# EAGLE board EEZ DIB MIO168 r2B4 (EAGLE 7.2.0), part 1 of 2
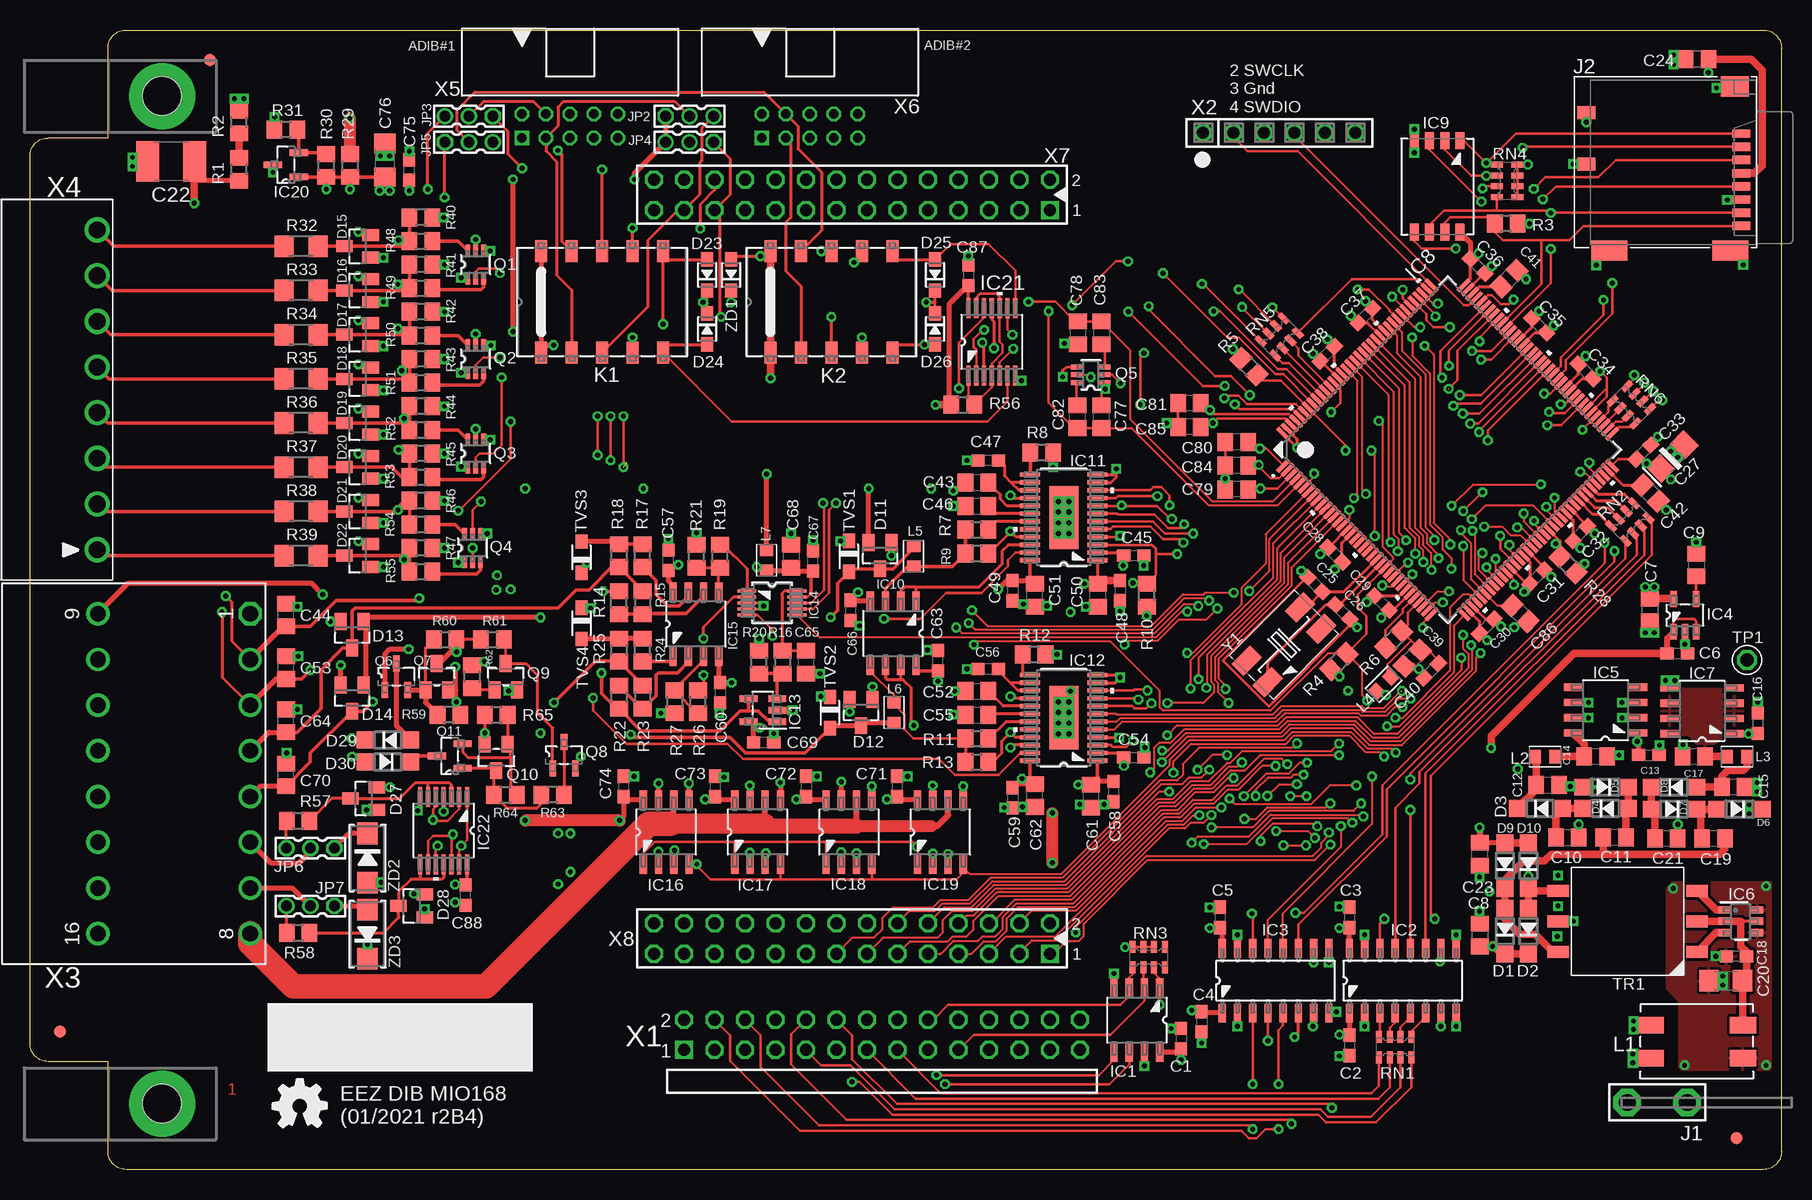
[diagram p6: board, top side]
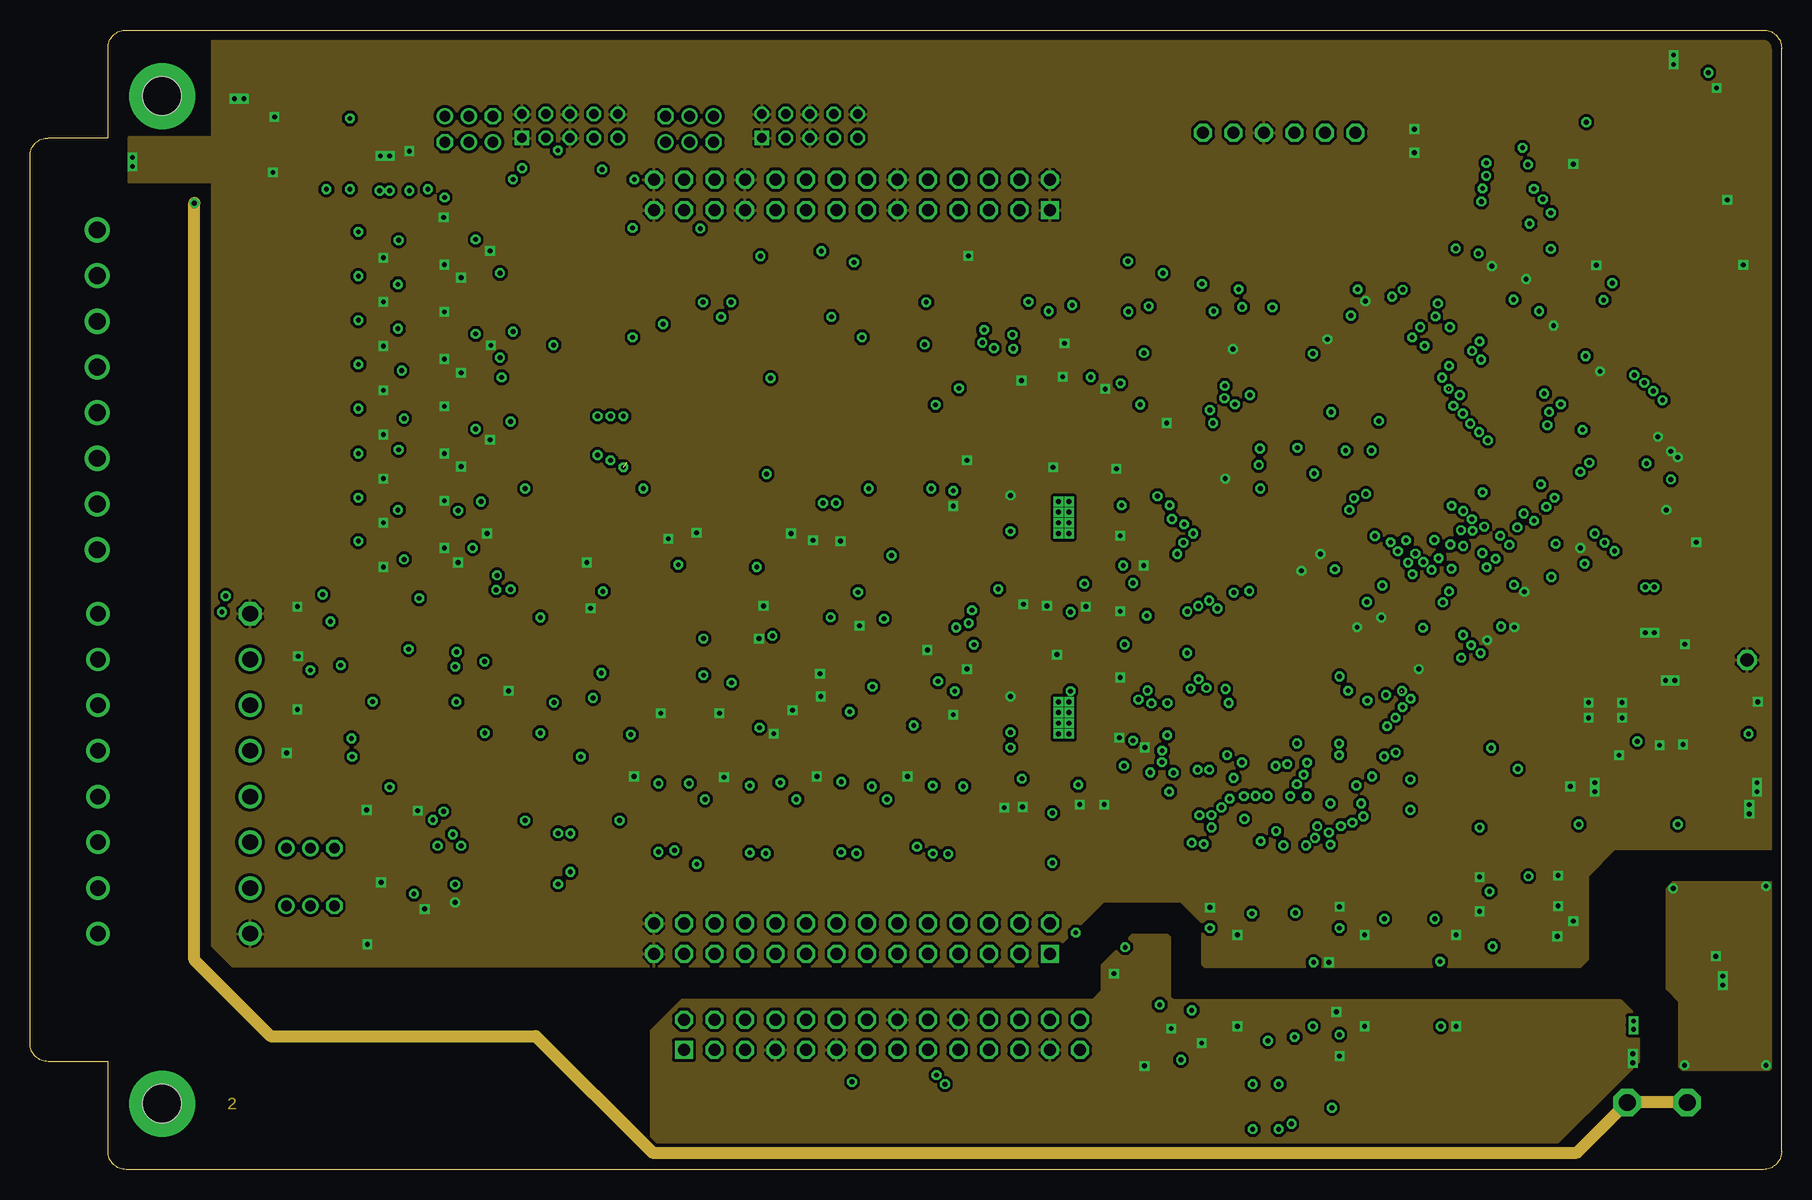
[diagram p7: board, inner layer L2]
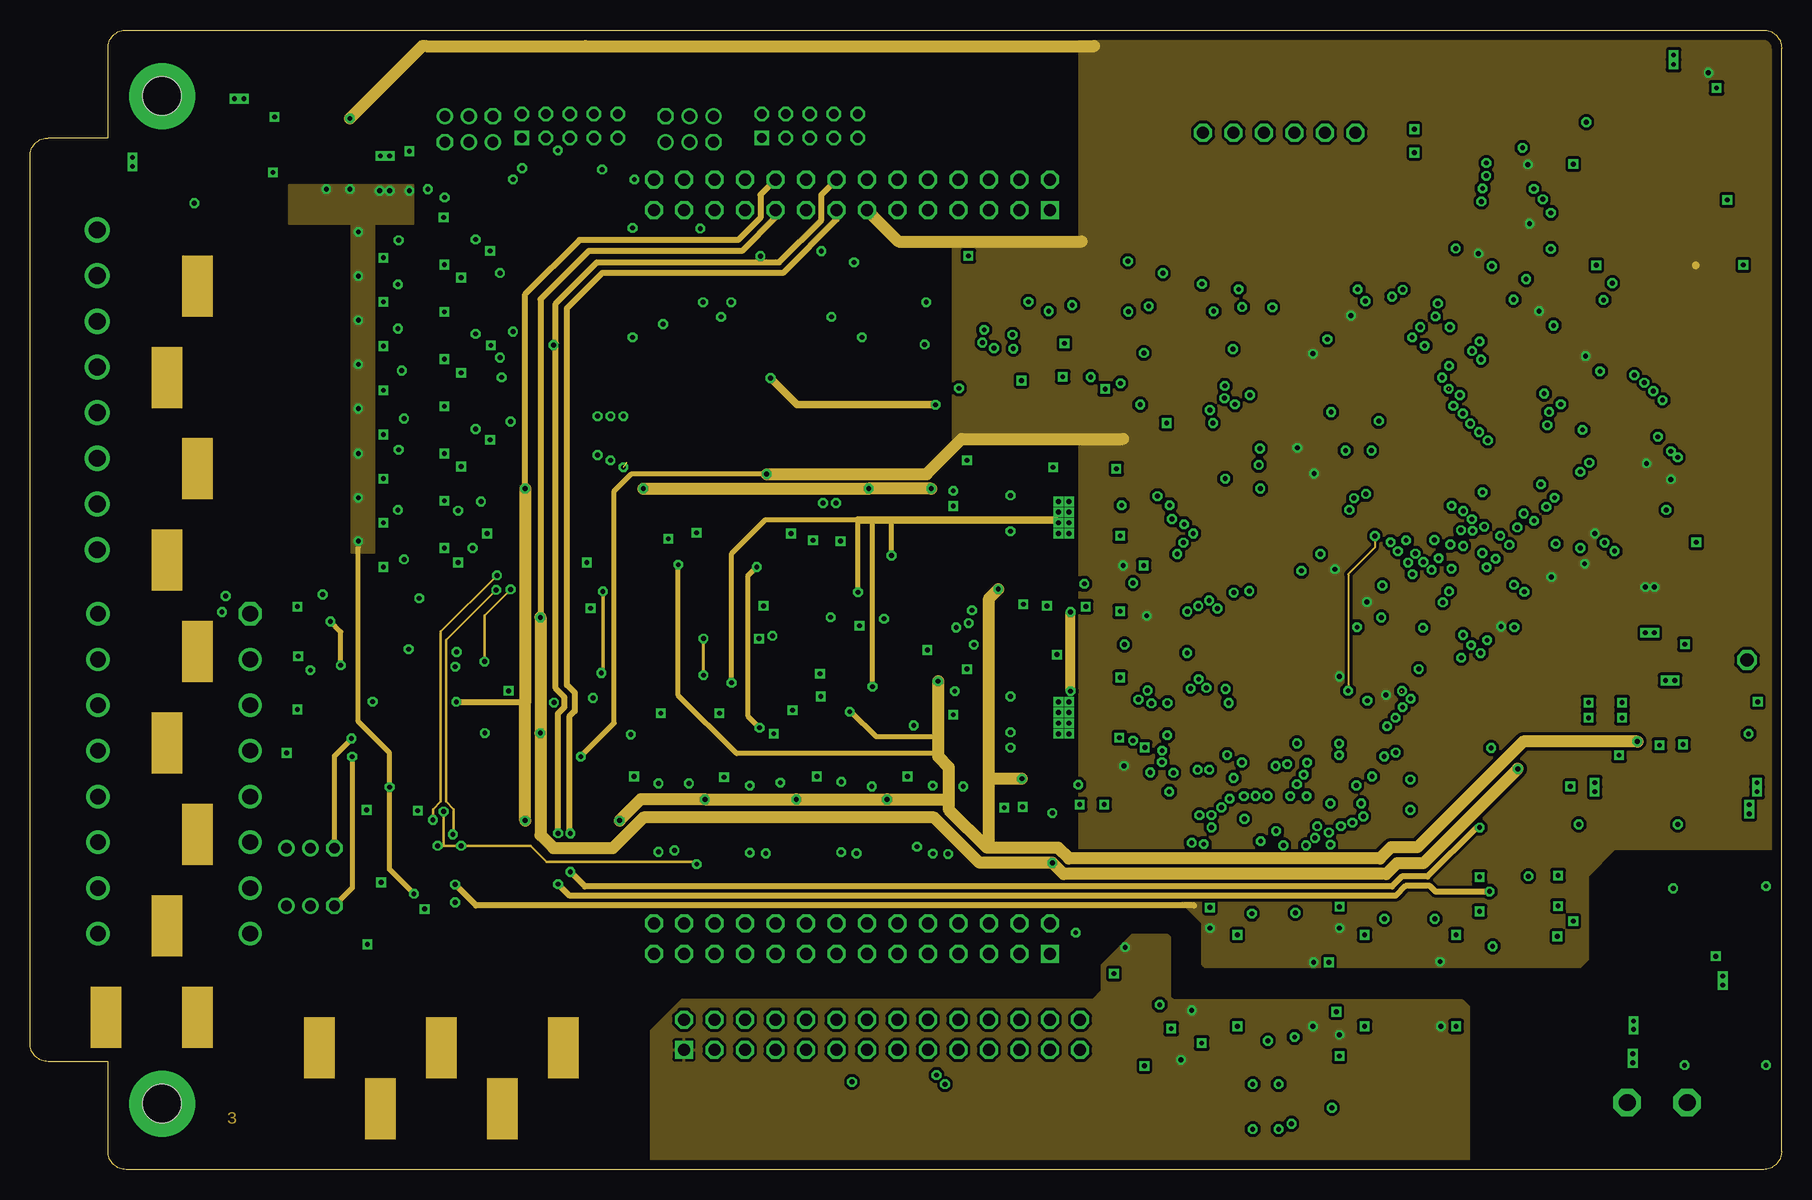
[diagram p8: board, inner layer L3]
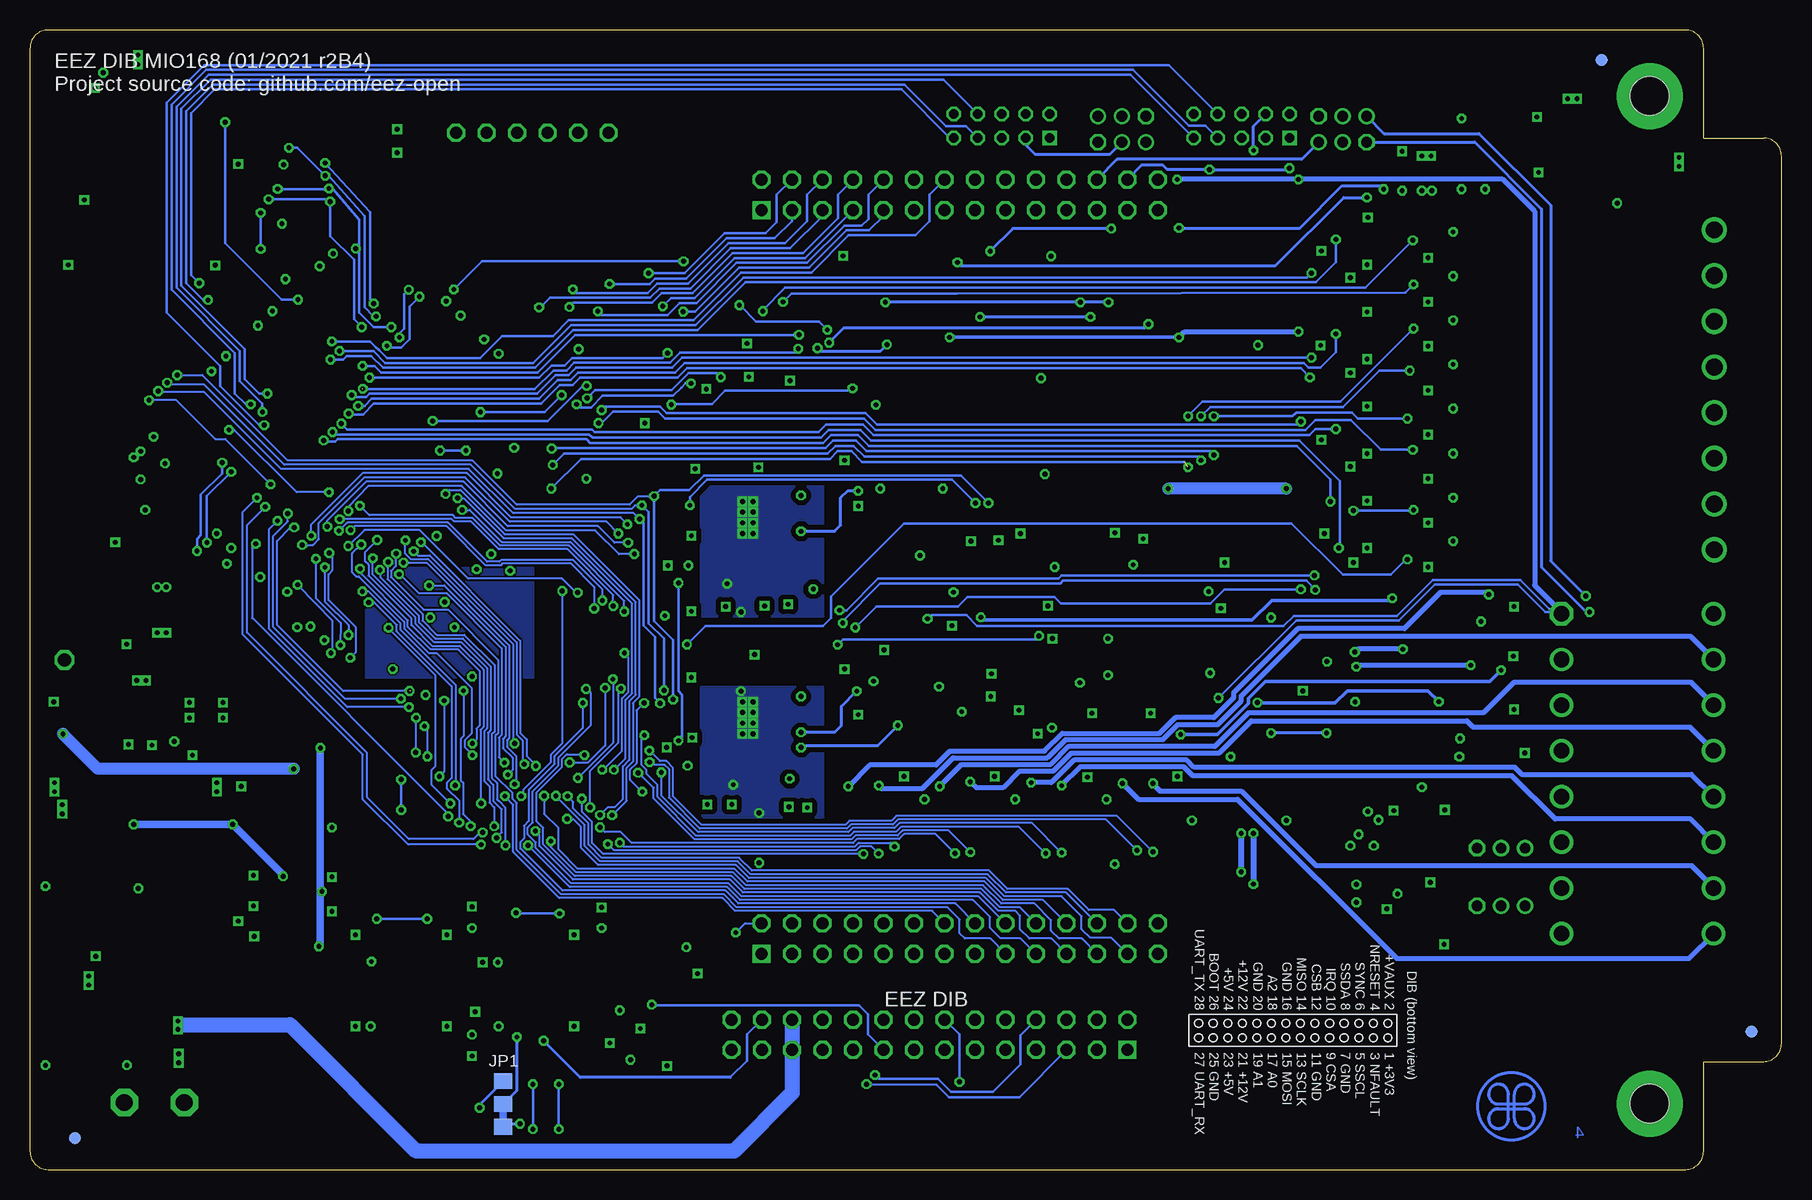
[diagram p9: board, bottom side, seen from below]

Size 146 x 95 mm. Coordinates in mm from the lower left corner, seen from the top.
Outline: 8,95 144.5,95 arc-90 146,93.5 146,1.5 arc-90 144.5,0 8,0 arc-90 6.5,1.5 6.5,9 1.5,9 arc-90 0,10.5 0,84.5 arc-90 1.5,86 6.5,86 6.5,93.5 arc-90 8,95
Copper layers (1+2+15+16): Top 0.035559375mm / dielectric 7mil / L2 0.03048125mm / dielectric 44mil / L3 0.03048125mm / dielectric 7mil / Bottom 0.035559375mm
Design rules "DIB 4-layer": minimum track width 6mil, minimum drill 0.3mm, track to track 4mil, track to pad 4mil, pad to pad 4mil, via to via 4mil, smd to smd 4mil, copper to edge 30mil, drill to drill 8mil, minimum pad ring 4mil, minimum via ring 8mil, stop-mask expansion 2.5mil, vias tented up to drill 0.6mm, thermal gap 8mil
Net classes: 0 default: width 0.152 mm, drill 0.3 mm, clearance 0.152 mm; 1 lvds: width 0.152 mm, drill 0.3 mm, clearance 0.152 mm to class 0, clearance 0.152 mm; 2 gnd: width 0.254 mm, drill 0.584 mm, clearance 0.254 mm; 3 diff_in: width 0.254 mm, drill 0.584 mm, clearance 0.203 mm to class 0, clearance 0.203 mm to class 1, clearance 0.203 mm to class 2, clearance 0.203 mm
vRestrict: area 0,0 to 42,14; area 53,0 to 128,8.5

## Footprints (pad centres in the part's own frame; a part is rotated, then mirrored left to right if it is on the bottom)
C0603 = smd 1.1 x 1: 1 -0.85,0; 2 0.85,0
C0805 = smd 1.3 x 1.5: 1 -0.95,0; 2 0.95,0
C1206 = smd 1.6 x 1.8: 1 -1.4,0; 2 1.4,0
C1812 = smd 1.9 x 3.4: 1 -1.95,0; 2 1.95,0
EC1206 = smd 1.6 x 1.8: + -1.4,0; - 1.4,0
SOD123 = smd 1.4 x 1.4: A 1.9,0; C -1.9,0
SOT23 = smd 1 x 1.4: 1 -0.95,-1.1; 2 0.95,-1.1; 3 0,1.1
SOD323-R = smd 1.2 x 1: A 1.3,0; C -1.3,0
FIDUCIAL_DUAL = smd 1.016 x 1.016 bottom: B 0,0 | smd 1.016 x 1.016: T 0,0
SOIC127P600X173-8N = smd 1.55 x 0.6: 1 -2.7,1.9; 2 -2.7,0.63; 3 -2.7,-0.64; 4 -2.7,-1.91; 5 2.7,-1.91; 6 2.7,-0.64; 7 2.7,0.63; 8 2.7,1.9
SOIC-16 = smd 1.549 x 0.61: 1 -2.692,4.445; 2 -2.692,3.175; 3 -2.692,1.905; 4 -2.692,0.635; 5 -2.692,-0.635; 6 -2.692,-1.905; 7 -2.692,-3.175; 8 -2.692,-4.445; 9 2.692,-4.445; 10 2.692,-3.175; 11 2.692,-1.905; 12 2.692,-0.635; 13 2.692,0.635; 14 2.692,1.905; 15 2.692,3.175; 16 2.692,4.445
SOT95P270X145-5N = smd 1.321 x 0.559: 1 -1.372,0.94; 2 -1.372,0; 3 -1.372,-0.94; 4 1.372,-0.94; 5 1.372,0.94
DBV0006A_N = smd 1 x 0.6: 1 -1.375,0.95; 2 -1.375,0; 3 -1.375,-0.95; 4 1.375,-0.95; 5 1.375,0; 6 1.375,0.95
LQFP-144 = smd 1.35 x 0.35: 1 -10.625,8.75; 2 -10.625,8.25; 3 -10.625,7.75; 4 -10.625,7.25; 5 -10.625,6.75; 6 -10.625,6.25; 7 -10.625,5.75; 8 -10.625,5.25; 9 -10.625,4.75; 10 -10.625,4.25; 11 -10.625,3.75; 12 -10.625,3.25; 13 -10.625,2.75; 14 -10.625,2.25; 15 -10.625,1.75; 16 -10.625,1.25; 17 -10.625,0.75; 18 -10.625,0.25; 19 -10.625,-0.25; 20 -10.625,-0.75; 21 -10.625,-1.25; 22 -10.625,-1.75; 23 -10.625,-2.25; 24 -10.625,-2.75; 25 -10.625,-3.25; 26 -10.625,-3.75; 27 -10.625,-4.25; 28 -10.625,-4.75; 29 -10.625,-5.25; 30 -10.625,-5.75; 31 -10.625,-6.25; 32 -10.625,-6.75; 33 -10.625,-7.25; 34 -10.625,-7.75; 35 -10.625,-8.25; 36 -10.625,-8.75; 73 10.625,-8.75; 74 10.625,-8.25; 75 10.625,-7.75; 76 10.625,-7.25; 77 10.625,-6.75; 78 10.625,-6.25; 79 10.625,-5.75; 80 10.625,-5.25; 81 10.625,-4.75; 82 10.625,-4.25; 83 10.625,-3.75; 84 10.625,-3.25; 85 10.625,-2.75; 86 10.625,-2.25; 87 10.625,-1.75; 88 10.625,-1.25; 89 10.625,-0.75; 90 10.625,-0.25; 91 10.625,0.25; 92 10.625,0.75; 93 10.625,1.25; 94 10.625,1.75; 95 10.625,2.25; 96 10.625,2.75; 97 10.625,3.25; 98 10.625,3.75; 99 10.625,4.25; 100 10.625,4.75; 101 10.625,5.25; 102 10.625,5.75; 103 10.625,6.25; 104 10.625,6.75; 105 10.625,7.25; 106 10.625,7.75; 107 10.625,8.25; 108 10.625,8.75 | smd 0.35 x 1.35: 37 -8.75,-10.625; 38 -8.25,-10.625; 39 -7.75,-10.625; 40 -7.25,-10.625; 41 -6.75,-10.625; 42 -6.25,-10.625; 43 -5.75,-10.625; 44 -5.25,-10.625; 45 -4.75,-10.625; 46 -4.25,-10.625; 47 -3.75,-10.625; 48 -3.25,-10.625; 49 -2.75,-10.625; 50 -2.25,-10.625; 51 -1.75,-10.625; 52 -1.25,-10.625; 53 -0.75,-10.625; 54 -0.25,-10.625; 55 0.25,-10.625; 56 0.75,-10.625; 57 1.25,-10.625; 58 1.75,-10.625; 59 2.25,-10.625; 60 2.75,-10.625; 61 3.25,-10.625; 62 3.75,-10.625; 63 4.25,-10.625; 64 4.75,-10.625; 65 5.25,-10.625; 66 5.75,-10.625; 67 6.25,-10.625; 68 6.75,-10.625; 69 7.25,-10.625; 70 7.75,-10.625; 71 8.25,-10.625; 72 8.75,-10.625; 109 8.75,10.625; 110 8.25,10.625; 111 7.75,10.625; 112 7.25,10.625; 113 6.75,10.625; 114 6.25,10.625; 115 5.75,10.625; 116 5.25,10.625; 117 4.75,10.625; 118 4.25,10.625; 119 3.75,10.625; 120 3.25,10.625; 121 2.75,10.625; 122 2.25,10.625; 123 1.75,10.625; 124 1.25,10.625; 125 0.75,10.625; 126 0.25,10.625; 127 -0.25,10.625; 128 -0.75,10.625; 129 -1.25,10.625; 130 -1.75,10.625; 131 -2.25,10.625; 132 -2.75,10.625; 133 -3.25,10.625; 134 -3.75,10.625; 135 -4.25,10.625; 136 -4.75,10.625; 137 -5.25,10.625; 138 -5.75,10.625; 139 -6.25,10.625; 140 -6.75,10.625; 141 -7.25,10.625; 142 -7.75,10.625; 143 -8.25,10.625; 144 -8.75,10.625
LGA8 = smd 1.4 x 0.75: 1 -3.81,1.905; 2 -3.81,0.635; 3 -3.81,-0.635; 4 -3.81,-1.905; 5 3.81,-1.905; 6 3.81,-0.635; 7 3.81,0.635; 8 3.81,1.905
PWP24 = smd 1.676 x 0.356: 1 -2.819,3.575; 2 -2.819,2.925; 3 -2.819,2.275; 4 -2.819,1.625; 5 -2.819,0.975; 6 -2.819,0.325; 7 -2.819,-0.325; 8 -2.819,-0.975; 9 -2.819,-1.625; 10 -2.819,-2.275; 11 -2.819,-2.925; 12 -2.819,-3.575; 13 2.819,-3.575; 14 2.819,-2.925; 15 2.819,-2.275; 16 2.819,-1.625; 17 2.819,-0.975; 18 2.819,-0.325; 19 2.819,0.325; 20 2.819,0.975; 21 2.819,1.625; 22 2.819,2.275; 23 2.819,2.925; 24 2.819,3.575 | smd 2.413 x 5.283: 25 0,0
DBV5 = smd 1.473 x 0.559: 1 -1.194,0.95; 2 -1.194,0; 3 -1.194,-0.95; 4 1.194,-0.95; 5 1.194,0.95
DGS10 = smd 1.575 x 0.254: 1 -2.095,1; 2 -2.095,0.5; 3 -2.095,0; 4 -2.095,-0.5; 5 -2.095,-1; 6 2.095,-1; 7 2.095,-0.5; 8 2.095,0; 9 2.095,0.5; 10 2.095,1
SOT103P240X110-3N = smd 1.524 x 0.559: 1 -1.079,1.016; 2 -1.079,-1.016; 3 1.079,0
PW14 = smd 1.676 x 0.356: 1 -2.819,1.95; 2 -2.819,1.3; 3 -2.819,0.65; 4 -2.819,0; 5 -2.819,-0.65; 6 -2.819,-1.3; 7 -2.819,-1.95; 8 2.819,-1.95; 9 2.819,-1.3; 10 2.819,-0.65; 11 2.819,0; 12 2.819,0.65; 13 2.819,1.3; 14 2.819,1.95
PCB_TAB-4907 = drill 1.4 pad 2.3 octagon: 1 -2.5,0; 2 2.5,0
5033981892 = smd 0.7 x 1.5: 1 4.45,12.6; 2 5.55,12.6; 3 6.65,12.6; 4 7.75,12.6; 5 8.85,12.6; 6 9.95,12.6; 7 11.05,12.6; 8 12.15,12.6 | smd 1.7 x 2.33: S 0.5,12.04 | smd 1.7 x 3: S1 14.2,11.7; S2 14.2,1.6 | smd 1.1 x 1.5: SW1 2.7,-0.3; SW2 7,-0.3
JP3-0805-CUT2 = smd 1.3 x 1.5: COM 0,0; NC 1.9,0; NO -1.9,0
ZL303-03P = drill 0.9 pad 1.27: 1 2,0; 2 0,0 | drill 0.9 pad 1.27 octagon: 3 -2,0
PANASONIC_TQ2_SS = smd 1.84 x 1: 1 -4.23,5.08; 2 -4.23,2.54; 3 -4.23,0; 4 -4.23,-2.54; 5 -4.23,-5.08; 6 4.23,-5.08; 7 4.23,-2.54; 8 4.23,0; 9 4.23,2.54; 10 4.23,5.08
PCB-MB = hole 3.2: 0,0
SRF0905 = smd 2.2 x 1.4: 1 3.85,-1.37; 2 3.85,1.37; 3 -3.85,1.37; 4 -3.85,-1.37
BEAD0603 = smd 1 x 1.1: P$1 -0.85,0; P$2 0.85,0
SC88 = smd 0.991 x 0.406: 1 -1.168,0.65; 2 -1.168,0; 3 -1.168,-0.65; 4 1.168,-0.65; 5 1.168,0; 6 1.168,0.65
SOT95P237X112-3N = smd 1.321 x 0.559: 1 -1.092,0.94; 2 -1.092,-0.94; 3 1.092,0
SOT23-BEC = smd 1 x 1.4: B -0.95,-1.1; C 0,1.1; E 0.95,-1.1
R0805 = smd 1.3 x 1.5: 1 -0.95,0; 2 0.95,0
R1206 = smd 1.6 x 1.803: 1 -1.422,0; 2 1.422,0
CAY16 = smd 0.5 x 1: 1 -1.35,-0.85; 2 -0.45,-0.85; 3 0.45,-0.85; 4 1.35,-0.85; 5 1.35,0.85; 6 0.45,0.85; 7 -0.45,0.85; 8 -1.35,0.85
SHORT_NOHOLE = smd 0.5 x 0.25 bottom: 1 0,0.117; 2 0,-0.117
PCB_SHIELD_TAB = drill 1.1 octagon: 1 0,0
MURATA_78615 = smd 1.8 x 1: 1 -5.8,2.54; 2 -5.8,0; 3 -5.8,-2.54; 4 5.8,-2.54; 5 5.8,0; 6 5.8,2.54
SOD323-BIDIR = smd 1.2 x 1: C1 -1.3,0; C2 1.3,0
77317-104-28LF = drill 1 pad 1.5 square: 1 -33.02,-2.54 | drill 1 pad 1.5 octagon: 2 -33.02,0; 3 -30.48,-2.54; 4 -30.48,0; 5 -27.94,-2.54; 6 -27.94,0; 7 -25.4,-2.54; 8 -25.4,0; 9 -22.86,-2.54; 10 -22.86,0; 11 -20.32,-2.54; 12 -20.32,0; 13 -17.78,-2.54; 14 -17.78,0; 15 -15.24,-2.54; 16 -15.24,0; 17 -12.7,-2.54; 18 -12.7,0; 19 -10.16,-2.54; 20 -10.16,0; 21 -7.62,-2.54; 22 -7.62,0; 23 -5.08,-2.54; 24 -5.08,0; 25 -2.54,-2.54; 26 -2.54,0; 27 0,-2.54; 28 0,0
SSW-106-02-S-S = drill 1 pad 1.5 octagon: 1 -6.35,0; 2 -3.81,0; 3 -1.27,0; 4 1.27,0; 5 3.81,0; 6 6.35,0
691327310016 = drill 1.3 octagon: 1 -13.335,6.35 | drill 1.3: 2 -9.525,6.35; 3 -5.715,6.35; 4 -1.905,6.35; 5 1.905,6.35; 6 5.715,6.35; 7 9.525,6.35; 8 13.335,6.35; 9 -13.335,-6.35; 10 -9.525,-6.35; 11 -5.715,-6.35; 12 -1.905,-6.35; 13 1.905,-6.35; 14 5.715,-6.35; 15 9.525,-6.35; 16 13.335,-6.35
691322310008 = drill 1.4: 1 -13.335,0; 2 -9.525,0; 3 -5.715,0; 4 -1.905,0; 5 1.905,0; 6 5.715,0; 7 9.525,0; 8 13.335,0
DS1014-10RF1B = drill 0.8 square: 1 -4,-1 | drill 0.8 octagon: 2 -4,1; 3 -2,-1; 4 -2,1; 5 0,-1; 6 0,1; 7 2,-1; 8 2,1; 9 4,-1; 10 4,1
TSW-114-07-F-D = drill 1 pad 1.5 square: 1 33.02,0 | drill 1 pad 1.5 octagon: 2 33.02,2.54; 3 30.48,0; 4 30.48,2.54; 5 27.94,0; 6 27.94,2.54; 7 25.4,0; 8 25.4,2.54; 9 22.86,0; 10 22.86,2.54; 11 20.32,0; 12 20.32,2.54; 13 17.78,0; 14 17.78,2.54; 15 15.24,0; 16 15.24,2.54; 17 12.7,0; 18 12.7,2.54; 19 10.16,0; 20 10.16,2.54; 21 7.62,0; 22 7.62,2.54; 23 5.08,0; 24 5.08,2.54; 25 2.54,0; 26 2.54,2.54; 27 0,0; 28 0,2.54
12SMX(B) = smd 2.2 x 1.4: 1 -3.15,-1.25; 2 3.14,-1.25; 3 3.15,1.25; 4 -3.15,1.25
DO214AC = smd 1.8 x 1.7: A 2.05,0; C -2.05,0

## Placement (x,y rotation side)
C1  100n  [C0603]  95.95,10.92 270 top
C2  100n  [C0603]  109.98,10.35 270 top
C3  100n  [C0603]  109.98,21.02 270 top
C4  100n  [C0603]  97.66,12.32 270 top
C5  100n  [C0603]  99.19,21.02 270 top
C6  100n  [C0603]  137.31,43.03 0 top
C7  2u2  [C0805]  135.03,46.65 270 top
C8  4u7  [C0805]  120.84,19.56 270 top
C9  10n  [C0805]  138.9,50.39 270 top
C10  1u  [C0805]  128.14,27.69 0 top
C11  1u  [C0805]  132.08,27.69 180 top
C12  4u7  [C0805]  126.49,32.07 0 top
C13  100n  [C0603]  134.94,34.54 0 top
C14  1u  [C0805]  130.49,34.42 180 top
C15  4u7  [C0805]  141.99,31.88 180 top
C16  100n  [C0603]  144.02,37.21 270 top
C17  1u  [C0805]  138.68,34.42 180 top
C18  100n  [C0603]  142.24,17.78 180 top
C19  1u  [C0805]  140.34,27.62 0 top
C20  10u  [C1206]  141.35,15.75 0 top
C21  1u  [C0805]  136.4,27.62 0 top
C22  4n7/1kV  [C1812]  11.77,84.05 180 top
C23  4u7  [C0805]  120.84,26.29 90 top
C24  N.C.  [C0805]  138.95,92.57 180 top
C25  4p7  [C0603]  107.12,48.77 315 top
C26  4p7  [C0603]  109.41,46.48 135 top
C27  4u7  [EC1206]  136.91,59.44 45 top
C28  100n  [C0603]  108.8,51.26 135 top
C29  100n  [C0603]  112.69,47.23 315 top
C30  100n  [C0603]  121.42,45.29 225 top
C31  100n  [C0603]  125.6,49.4 225 top
C32  100n  [C0603]  129.22,53.02 225 top
C33  100n  [C0603]  134.49,59.82 45 top
C34  100n  [C0603]  129.67,66.55 315 top
C35  100n  [C0603]  125.79,70.36 315 top
C36  100n  [C0603]  120.68,75.31 315 top
C37  100n  [C0603]  111.32,71.18 45 top
C38  100n  [C0603]  108.14,68.01 45 top
C39  1u  [C0805]  115.23,42.62 225 top
C40  100n  [C0603]  116.8,41.58 225 top
C41  2u2  [C0805]  123.29,74.28 225 top
C42  2u2  [C0805]  135.06,56.39 135 top
C43  2n2  [C0805]  78.93,57.28 0 top
C44  1n  [C0805]  21.34,46.23 90 top
C45  100n  [C0603]  92.01,51.18 0 top
C46  22n  [C0805]  78.93,55.31 0 top
C47  100n  [C0603]  79.88,59.12 180 top
C48  100n  [C0603]  90.87,48.26 270 top
C49  100n  [C0603]  81.92,48.26 270 top
C50  4u7  [C0805]  89.03,47.88 90 top
C51  4u7  [C0805]  83.76,47.88 90 top
C52  2n2  [C0805]  78.93,39.88 0 top
C53  1n  [C0805]  21.34,41.85 90 top
C54  100n  [C0603]  92.01,34.35 0 top
C55  22n  [C0805]  78.93,37.91 0 top
C56  100n  [C0603]  79.88,41.72 180 top
C57  100n  [C0603]  53.21,50.8 90 top
C58  100n  [C0603]  90.3,31.51 270 top
C59  100n  [C0603]  81.92,30.99 270 top
C60  100n  [C0603]  57.53,39.75 270 top
C61  4u7  [C0805]  88.46,31.13 90 top
C62  4u7  [C0805]  83.76,31.18 90 top
C63  100n  [C0603]  75.69,42.42 90 top
C64  1n  [C0805]  21.34,37.4 90 top
C65  150n  [C0805]  64.71,42.29 90 top
C66  100n  [C0603]  68.39,46.61 270 top
C67  100n  [C0603]  65.28,50.74 90 top
C68  4u7  [C0805]  63.44,51.12 270 top
C69  100n  [C0603]  61.15,35.62 0 top
C70  1n  [C0805]  21.34,32.89 90 top
C71  100n  [C0603]  72.26,31.94 270 top
C72  100n  [C0603]  64.71,31.94 270 top
C73  100n  [C0603]  57.09,31.94 270 top
C74  100n  [C0603]  49.47,31.94 270 top
C75  100n  [C0603]  31.62,83.31 90 top
C76  10u  [C1206]  29.59,84.14 90 top
C77  100p  [C0805]  89.31,62.76 90 top
C78  100p  [C0805]  87.34,69.75 270 top
C79  10n  [C0805]  100.58,56.71 180 top
C80  10n  [C0805]  100.58,60.64 180 top
C81  10n  [C0805]  96.65,63.88 180 top
C82  10n  [C0805]  87.33,62.76 90 top
C83  10n  [C0805]  89.31,69.75 270 top
C84  10n  [C0805]  100.58,58.67 180 top
C85  10n  [C0805]  96.65,61.91 180 top
C86  100p  [C0805]  124.21,46.35 315 top
C87  100n  [C0603]  78.22,74.54 270 top
C88  100n  [C0603]  36.32,22.87 90 top
D1  MBR0530T3G  [SOD123]  122.94,19.88 90 top
D2  MBR0530T3G  [SOD123]  124.9,19.88 90 top
D3  MBR0530T3G  [SOD123]  125.86,30.1 0 top
D4  MBR0530T3G  [SOD123]  131.32,30.1 0 top
D5  MBR0530T3G  [SOD123]  131.32,31.88 180 top
D6  MBR0530T3G  [SOD123]  142.49,30.04 180 top
D7  MBR0530T3G  [SOD123]  137.03,30.04 180 top
D8  MBR0530T3G  [SOD123]  137.03,31.88 0 top
D9  MBR0530T3G  [SOD123]  122.94,25.34 90 top
D10  MBR0530T3G  [SOD123]  124.9,25.34 90 top
D11  N.C.  [SOT23]  70.87,51.18 180 top
D12  N.C.  [SOT23]  69.28,38.1 180 top
D13  N.C.  [SOT23]  26.86,44.58 180 top
D14  N.C.  [SOT23]  26.86,39.31 180 top
D15  BAT54SFILM  [SOT23]  27.3,76.96 90 top
D16  BAT54SFILM  [SOT23]  27.3,73.28 90 top
D17  BAT54SFILM  [SOT23]  27.3,69.6 90 top
D18  BAT54SFILM  [SOT23]  27.3,65.91 90 top
D19  BAT54SFILM  [SOT23]  27.3,62.23 90 top
D20  BAT54SFILM  [SOT23]  27.3,58.55 90 top
D21  BAT54SFILM  [SOT23]  27.3,54.86 90 top
D22  BAT54SFILM  [SOT23]  27.3,51.18 90 top
D23  BAS316  [SOD323-R]  56.44,74.57 90 top
D24  BAS316  [SOD323-R]  56.44,70.08 270 top
D25  BAS316  [SOD323-R]  75.44,74.57 90 top
D26  BAS316  [SOD323-R]  75.44,70.08 270 top
D27  BAT54SFILM  [SOT23]  27.81,30.92 90 top
D28  BAT54SFILM  [SOT23]  31.81,21.97 90 top
D29  MBR0530T3G  [SOD123]  29.84,35.81 0 top
D30  MBR0530T3G  [SOD123]  29.84,33.97 180 top
EEZ_SIGNATURE  SIGNATURESMALL  [SIGNATURE_5MM]  22.51,5.26 180 top
FM1  FIDUCIAL_2  [FIDUCIAL_DUAL]  2.5,11.5 0 top
FM2  FIDUCIAL_2  [FIDUCIAL_DUAL]  15,92.5 0 top
FM3  FIDUCIAL_2  [FIDUCIAL_DUAL]  142.25,2.62 0 top
IC1  M24C32-WMN6P  [SOIC127P600X173-8N]  92.27,12.47 270 top
IC2  Si8641BB-B-IS1  [SOIC-16]  114.43,15.75 90 top
IC3  Si8641BB-B-IS1  [SOIC-16]  103.82,15.75 90 top
IC4  LP2985-33DBVR  [SOT95P270X145-5N]  137.95,46.2 90 top
IC5  L78L15  [SOIC127P600X173-8N]  131.32,38.29 180 top
IC6  SN6505BDBVT  [DBV0006A_N]  142.62,20.7 0 top
IC7  L79L15  [SOIC127P600X173-8N]  139.38,38.23 180 top
IC8  STM32F446ZCT6  [LQFP-144]  118.17,60.01 45 top
IC9  N.C.  [LGA8]  117.3,81.95 270 top
IC10  OPA2196IDR  [SOIC127P600X173-8N]  71.95,44.7 270 top
IC11  DAC7760IPWPR  [PWP24]  86.17,54.36 180 top
IC12  DAC7760IPWPR  [PWP24]  86.17,37.66 180 top
IC13  OPA376AIDBVR  [DBV5]  61.09,38.29 180 top
IC14  DAC7563TDGSR  [DGS10]  61.85,47.24 0 top
IC15  OPA2196IDR  [SOIC127P600X173-8N]  55.5,45.47 90 top
IC16  BTS3408G  [SOIC127P600X173-8N]  53.02,28.13 90 top
IC17  BTS3408G  [SOIC127P600X173-8N]  60.64,28.13 90 top
IC18  BTS3408G  [SOIC127P600X173-8N]  68.26,28.13 90 top
IC19  BTS3408G  [SOIC127P600X173-8N]  75.88,28.13 90 top
IC20  TL431B  [SOT103P240X110-3N]  21.34,83.76 180 top
IC21  74HC126PW,118  [PW14]  80.18,69 90 top
IC22  74HC126PW,118  [PW14]  34.48,28.26 270 top
J1  4907  [PCB_TAB-4907]  135.64,5.59 180 top
J2  N.C.  [5033981892]  130.05,90.81 270 top
JP1  JP3-CUT-0805-ROTATED  [JP3-0805-CUT2]  106.55,5.46 270 bottom
JP2  DS1025-01-1*3P8BV1-B  [ZL303-03P]  54.98,87.81 0 top
JP3  DS1025-01-1*3P8BV1-B  [ZL303-03P]  36.58,87.81 180 top
JP4  DS1025-01-1*3P8BV1-B  [ZL303-03P]  54.98,85.65 180 top
JP5  DS1025-01-1*3P8BV1-B  [ZL303-03P]  36.58,85.65 0 top
JP6  DS1025-01-1*3P8BV1-B  [ZL303-03P]  23.37,26.8 180 top
JP7  DS1025-01-1*3P8BV1-B  [ZL303-03P]  23.37,21.97 180 top
K1  TQ2SS-L2-5V-X  [PANASONIC_TQ2_SS]  47.69,72.33 90 top
K2  TQ2SS-L2-5V-X  [PANASONIC_TQ2_SS]  66.8,72.33 90 top
KK1  PCB-MB  [PCB-MB]  11,89.5 0 top
KK2  PCB-MB  [PCB-MB]  11,5.5 0 top
L1  SRF0905-202Y  [SRF0905]  138.94,10.67 180 top
L2  BLM18AG102SH1D  [BEAD0603]  126.3,34.42 0 top
L3  BLM18AG102SH1D  [BEAD0603]  142.3,34.42 180 top
L4  BLM18AG102SH1D  [BEAD0603]  112.84,40.45 45 top
L5  BLM18AG102SH1D  [BEAD0603]  73.66,51.12 90 top
L6  BLM18AG102SH1D  [BEAD0603]  72.01,38.1 270 top
L7  BLM18AG102SH1D  [BEAD0603]  61.4,50.8 90 top
Q1  2N7002PS,115  [SC88]  37.15,75.44 90 top
Q2  2N7002PS,115  [SC88]  37.15,67.56 90 top
Q3  2N7002PS,115  [SC88]  37.15,59.69 90 top
Q4  2N7002PS,115  [SC88]  36.89,51.82 90 top
Q5  2N7002PS,115  [SC88]  88.42,66.26 180 top
Q6  BSS84P  [SOT95P237X112-3N]  30.53,41.08 90 top
Q7  MMBT5401  [SOT23-BEC]  33.91,41.08 0 top
Q8  BSS84P  [SOT95P237X112-3N]  44.51,34.54 90 top
Q9  MMBT5551  [SOT23-BEC]  39.66,41.08 0 top
Q10  MMBT5551  [SOT23-BEC]  38.86,34.35 180 top
Q11  2N7002  [SOT103P240X110-3N]  34.99,34.48 180 top
R1  470K  [R0805]  17.44,83.38 90 top
R2  470K  [R0805]  17.44,87.31 90 top
R3  N.C.  [R0805]  123.05,78.85 180 top
R4  4K7  [R0805]  109.09,42.35 45 top
R5  10K  [R0805]  101.6,66.93 315 top
R6  47R  [R0805]  113.67,44.2 225 top
R7  15R  [R0805]  78.93,53.34 0 top
R8  N.C.  [R0805]  84.33,59.75 180 top
R9  15R  [R0805]  78.93,51.37 0 top
R10  10K  [R0805]  93.09,47.88 90 top
R11  15R  [R0805]  78.93,35.94 0 top
R12  N.C.  [R0805]  83.69,42.93 180 top
R13  15R  [R0805]  78.93,33.97 0 top
R14  9K09 0.1%  [R0805]  49.09,47.24 90 top
R15  75K 0.1%  [R0805]  51.05,47.24 270 top
R16  9K09 0.1%  [R0805]  62.74,42.29 270 top
R17  180R  [R0805]  51.05,51.18 90 top
R18  47R  [R0805]  49.09,51.18 270 top
R19  9K09 0.1%  [R0805]  57.53,51.12 90 top
R20  9K09 0.1%  [R0805]  60.77,42.29 90 top
R21  75K 0.1%  [R0805]  55.56,51.12 90 top
R22  9K09 0.1%  [R0805]  49.09,39.37 270 top
R23  75K 0.1%  [R0805]  51.05,39.37 270 top
R24  180R  [R0805]  51.05,43.31 90 top
R25  47R  [R0805]  49.09,43.31 270 top
R26  9K09 0.1%  [R0805]  55.69,38.99 90 top
R27  75K 0.1%  [R0805]  53.72,38.99 270 top
R28  10K  [R0805]  128.21,50.42 135 top
R29  100R  [R0805]  26.67,83.69 270 top
R30  470R  [R0805]  24.7,83.69 90 top
R31  1K8  [R0805]  21.34,86.68 180 top
R32  2K7  [R1206]  22.61,76.96 0 top
R33  2K7  [R1206]  22.61,73.28 0 top
R34  2K7  [R1206]  22.61,69.6 0 top
R35  2K7  [R1206]  22.61,65.91 0 top
R36  2K7  [R1206]  22.61,62.23 0 top
R37  2K7  [R1206]  22.61,58.55 0 top
R38  2K7  [R1206]  22.61,54.86 0 top
R39  2K7  [R1206]  22.61,51.18 0 top
R40  27K  [R0805]  32.58,79.38 180 top
R41  27K  [R0805]  32.58,75.44 180 top
R42  27K  [R0805]  32.58,71.5 180 top
R43  27K  [R0805]  32.58,67.56 180 top
R44  27K  [R0805]  32.58,63.63 180 top
R45  27K  [R0805]  32.58,59.69 180 top
R46  27K  [R0805]  32.58,55.75 180 top
R47  27K  [R0805]  32.58,51.82 180 top
R48  1K  [R0805]  32.58,77.41 0 top
R49  1K  [R0805]  32.58,73.47 0 top
R50  1K  [R0805]  32.58,69.53 0 top
R51  1K  [R0805]  32.58,65.6 0 top
R52  1K  [R0805]  32.58,61.66 0 top
R53  1K  [R0805]  32.58,57.72 0 top
R54  1K  [R0805]  32.58,53.78 0 top
R55  1K  [R0805]  32.58,49.85 0 top
R56  100K  [R0805]  77.75,63.75 0 top
R57  100R  [R0805]  22.35,29.08 0 top
R58  100R  [R0805]  22.35,19.75 0 top
R59  47R  [R0805]  34.92,37.91 180 top
R60  100K  [R0805]  34.61,44.2 0 top
R61  10K  [R0805]  38.54,44.2 0 top
R62  470R  [R0805]  36.84,41.08 270 top
R63  10K  [R0805]  43.56,31.24 180 top
R64  100K  [R0805]  39.62,31.24 0 top
R65  47R  [R0805]  38.86,37.91 0 top
RN1  DR1206-33R-4/8  [CAY16]  113.79,10.22 180 top
RN2  DR1206-33R-4/8  [CAY16]  133.35,53.98 45 top
RN3  DR1206-47K-4/8  [CAY16]  93.26,17.7 0 top
RN4  N.C.  [CAY16]  123.14,82.41 90 top
RN5  DR1206-33R-4/8  [CAY16]  104.14,69.41 225 top
RN6  DR1206-33R-4/8  [CAY16]  133.48,63.75 135 top
SH1  [SHORT_NOHOLE]  18.35,46.35 180 top
SH2  [SHORT_NOHOLE]  18.22,19.68 270 bottom
TP1  [PCB_SHIELD_TAB]  143.13,42.48 0 top
TR1  WE-750315371  [MURATA_78615]  133.16,20.7 180 top
TVS1  PESD12VL1BA,115  [SOD323-BIDIR]  68.26,51.12 270 top
TVS2  PESD12VL1BA,115  [SOD323-BIDIR]  66.67,38.1 270 top
TVS3  PESD12VL1BA,115  [SOD323-BIDIR]  45.97,51.05 90 top
TVS4  PESD12VL1BA,115  [SOD323-BIDIR]  45.97,45.53 270 top
X1  77317-104-28LF  [77317-104-28LF]  87.54,12.5 0 top
X2  N.C.  [SSW-106-02-S-S]  104.14,86.42 0 top
X3  691327310016  [691327310016]  12,33 270 top
X4  691322310008  [691322310008]  5.6,65 90 top
X5  DS1014-10RF1B  [DS1014-10RF1B]  45,87 0 top
X6  DS1014-10RF1B  [DS1014-10RF1B]  65,87 0 top
X7  DS1023-2*14S21  [TSW-114-07-F-D]  52,80 0 top
X8  DS1023-2*14S21  [TSW-114-07-F-D]  52,18 0 top
Y1  LF XTAL026392  [12SMX(B)]  104.52,43.75 45 top
ZD1  MM3Z18VT1G  [SOD323-R]  58.45,74.57 90 top
ZD2  SMAJ16A  [DO214AC]  28.13,25.97 270 top
ZD3  SMAJ16A  [DO214AC]  28.13,19.62 90 top

## Tracks (layer width: path | path; a pad name or v marks a point on that pad's centre or on a via)
1V25_REF  (via drill 0.4)
  Top 0.305: 59.88,38.23 60.71,38.23 61.59,37.34 IC13.1 | 59.88,38.23 59.18,38.23 57.53,36.58 50.93,36.58 R22.2 48.89,38.42 47.62,39.69 v47.62,41.4 | IC13.4 59.89,38.24 59.88,38.23 | R14.2 v47.75,48.2
  L3 0.305: v47.62,41.4 47.75,41.53 v47.75,48.2
2V5_REF
  Top 0.254: IC14.10 62.91,48.24 62.67,48.01 62.67,43.3 R16.1 C65.2
!ADC_CS  (via drill 0.4)
  Top 0.203: RN5.1 v103.57,71.88
  Bottom 0.203: v103.57,71.88 103.44,71.88 102.65,72.67 94.32,72.67 93.53,73.46 90.96,73.46 87.61,76.81 82.63,76.81 79.94,79.5 X7.5
!ADC_DRDY  (via drill 0.4)
  Top 0.203: IC8.132 109.22,65.07 109.22,63.91 v108.46,63.14 | v101.69,64.57 100.1,66.15 98.78,66.15 93.26,71.68 v93.26,71.97
  Bottom 0.203: X7.7 81.4,76 87.26,76 90.61,72.64 92.58,72.64 v93.26,71.97 | v101.69,64.57 103.11,63.14 v108.46,63.14
!DAC_ALARM  (via drill 0.4)
  Top 0.152: v121.08,56.46 v121.07,56.46 v119.47,54.89
  Top 0.203: R10.2 | IC8.77 129.41,61.7 v129.41,61.66 | IC11.3 93.53,52.08 93.85,51.75 93.85,51.31 | 93.85,51.31 93.85,49.59 R10.2 | R10.2 92.01,48.83 v91.95,48.9 | v91.95,35.75 91.89,35.75 91.38,35.24 90.23,35.24 90.1,35.38 IC12.3 | 93.85,51.31 v95.63,51.31
  Bottom 0.152: v95.63,51.31 96.9,51.31 98.88,53.29 106.32,53.29 110.02,56.98 117.81,56.98 119.47,55.24 v119.47,54.89 | v121.08,56.46 123.77,56.46 128.97,61.66 v129.41,61.66
  Bottom 0.203: v91.95,48.9 91.95,39.88 91.63,39.56 91.63,36.07 v91.95,35.75
!DAC_CS_DUAL  (via drill 0.4)
  Top 0.152: IC14.6 65.78,44.41 93.89,44.41 96,46.52 v96.47,46.52 | v125.95,57.12 120.29,57.12 v118.5,55.33
  Top 0.203: RN6.1 135.77,64.14 v136.08,64.14
  Bottom 0.152: v136.08,64.14 133.79,64.14 130.56,60.9 129.72,60.9 v125.95,57.12 | v96.47,46.52 96.47,47.41 101.08,52.02 106.79,52.02 109.11,54.33 110.53,54.33 110.74,54.55 117.72,54.55 v118.5,55.33
!DOUT_FAULT  (via drill 0.4)
  Top 0.152: R28.2 127.53,51.8 v127.18,52.16 | v96.84,27.24 97.37,27.77 101.61,27.77 103.4,29.57 111.02,29.57 v111.15,29.44
  Top 0.203: 51.12,25.72 IC16.1 51.12,26.37 52.06,27.3 58.74,27.3 | 66.36,27.3 58.74,27.3 | IC18.1 66.36,27.3 | IC17.1 58.74,27.3 | IC19.1 73.98,26.87 v73.94,26.91 73.55,27.3 66.36,27.3
  Top 0.254: IC8.57 127.53,52.41 R28.2
  Bottom 0.152: v127.18,52.16 127.48,51.85 127.48,45.96 127.46,45.96 111.15,29.65 v111.15,29.44 | v96.84,27.24 96.51,26.91 77.27,26.91 76.94,27.24 74.27,27.24 v73.94,26.91
!RESET  (via drill 0.4)
  Top 0.152: v78.68,43.75 78.98,44.06 90.03,44.06 94.18,39.9 94.18,38.52 94.45,38.25 103.4,38.25 108.18,43.03 R4.2 111.02,41.77 111.02,39.55 v111.48,39.09 | IC8.25 113.6,50.84 113.6,51.05 112.78,51.88 112.78,62.06 v112.43,62.41 | v111.87,32.77 111.87,28.8 104.44,21.37 104.44,18.45
  Top 0.203: R4.2 111.38,44.64 111.38,46.16 110.68,46.86 110.68,47.92 IC8.25 | IC14.5 60.63,46.24 61.89,44.98 v61.89,44.49 | 104.44,18.45 IC3.12 | v99.59,65.33 97.75,65.33 v91.55,71.53
  Bottom 0.152: 111.89,32.78 v111.87,32.77 111.48,33.16 v111.48,39.09
  Bottom 0.203: v61.89,44.49 62.18,44.2 78.23,44.2 v78.68,43.75 | X7.9 74.86,79.48 76.05,78.3 77.94,78.3 81.05,75.18 86.89,75.18 90.55,71.53 v91.55,71.53 | v99.59,65.33 99.92,65.33 102.84,62.41 v112.43,62.41
+3V3  (via drill 0.4)
  Top 0.203: IC2.7 v117.6,11.94 | RN3.6 RN3.7 RN3.8 91.31,18.55 v91.29,18.53 | IC3.7 107,12.13 v106.93,11.94
  Top 0.406: IC3.1 97.78,13.06 C4.1 97.56,13.27 v96.84,13.27 | IC2.1 C2.1 109.94,11.24 v109.16,11.24 | v95.95,9.14 C1.2 95.65,9.77 IC1.8
  pour L3 (isolate 0.254): 51.82,0.19 51.82,11.62 54.36,14.16 88.65,14.16 89.41,14.92 89.41,17.08 91.88,19.56 94.81,19.56 95,19.37 95,14.35 95.25,14.1 119.38,14.1 119.89,13.59 119.89,0.19
+3V3_ISO  (via drill 0.4)
  Top 0.152: v107.04,58.03 107.04,57.71 IC8.6
  Top 0.203: IC8.72 132.41,59.22 C33.1 134.4,59.22 v134.75,58.86 135.16,58.45 C27.+ | R4.1 v109.16,41.1 | C7.1 135.41,47.98 v135.41,48.55 | R28.1 128.81,49.75 v129.59,50.51 | v45.91,34.42 45.45,33.96 Q8.2 | RN4.1 RN4.2 RN4.3 RN4.4 124.01,83.78 v124.87,83.78 | R3.1 v124.99,78.85
  Top 0.254: IC11.2 90.91,51.43 C45.1 91.16,50.4 v91.12,50.35 | R10.1 v93.09,46.16 | IC12.2 91.16,34.73 C54.1 91.19,34.71 v91.19,33.66 | IC8.144 105.29,60.52 v105.64,60.17 105.64,60.88 105.54,60.98 IC8.143 | v113.03,39.56 L4.P$1 | v108.78,50.04 C28.1 109.35,50.71 109.35,52.24 IC8.17 | v111.44,47.31 111.51,47.24 C29.1 114.13,47.83 IC8.30 | IC8.52 126.27,50.15 C31.1 126.27,49.94 v126.81,49.4 | IC8.39 121.33,45.89 C30.1 122.62,45.3 v122.62,45.28 | v130.43,53.02 C32.1 129.82,53.66 IC8.62 | IC8.84 129.07,66.3 C34.1 129.07,67.22 v129.67,67.82 | IC8.95 125.19,70.21 C35.1 v125.79,71.56 | IC8.108 120.07,74.28 C36.1 | v120.74,76.36 120.07,75.94 | IC8.121 111.49,70.58 C37.1 v110.11,71.18 | v106.93,68.01 v106.94,68.01 C38.1 107.59,67.41 IC8.131
  Top 0.305: IC22.14 36.43,23.83 C88.2
  Top 0.406: IC2.10 v117.54,17.34 | IC3.10 v107,17.27 | IC2.16 C3.2 109.19,20.17 v109.16,20.13 | v98.36,20.13 98.4,20.17 C5.2 99.38,19.98 IC3.16 | L7.P$2 v61.4,57.98 | IC9.8 120.07,77.27 120.07,75.94 C36.1
  Top 0.508: C88.2 36.28,23.76 v35.43,23.76
  Top 0.61: J2.4 143.74,83.06 144.39,83.71 144.39,91.64 143.46,92.57 C24.1 | 139.78,92.57 C24.1 | IC4.5 136.99,47.6 C7.1 | C24.1 v139.9,91.44
  Top 1.016: R29.1 v26.67,87.63
  L3 0.406: v61.4,57.98 50.1,57.98 48.7,56.58 48.7,37.21 v45.91,34.42
  L3 0.508: 46.35,93.66 46.35,93.6 46.29,93.66 | 33.08,93.66 33.02,93.66 | v35.43,23.76 37.19,22.01 97.05,22.01
  L3 0.61: 138.84,75.39 138.85,75.37
  L3 1.016: 88.71,93.66 46.29,93.66 33.02,93.66 32.7,93.66 v26.67,87.63 | v61.4,57.98 74.74,57.98 77.66,60.9 91.12,60.9 | 87.68,77.37 72.41,77.37 X7.13
  other vias: 134.65,48.55 136.78,57.53
  pour L3 (isolate 0.254, rank 3): 145.61,26.73 132.08,26.73 129.79,24.45 129.79,17.46 129.22,16.89 97.98,16.89 97.79,17.08 97.79,20.51 95.95,22.35 87.5,22.35 87.5,60.91 76.97,60.91 76.97,76.97 86.54,76.97 87.5,77.06 87.5,95.12 144.59,95.12 145.61,94.11
+5V  (via drill 0.4)
  Top 0.406: L1.1 134.01,12.04 v133.67,12.38 v133.67,11.68
  L3 0.254: 133.67,12.06 v133.67,12.38
  Bottom 0.203: 133.41,12.06 133.29,12.06 v133.67,11.68
  Bottom 1.27: X1.24 X1.23 82.46,6.38 87.31,1.52 113.79,1.52 124.33,12.06 133.41,12.06
+5V_ISO  (via drill 0.4)
  Top 0.203: IC4.3 138.89,45.71 138.71,45.88 137.25,45.88 137,45.63 137,44.84 IC4.1
  Top 0.254: ZD1.A 58.72,76.15 v60.88,76.15 61.31,76.15 K2.10 | IC21.14 C87.2
  Top 0.406: v43.64,68.73 42.63,68.73 42.61,68.71 K1.1 K1.10 | C87.2 78.16,73.69 76.64,72.17 76.64,63.91 R56.1
  Top 0.508: C8.2 v121.92,18.61 122.55,17.98 D1.C | C6.1 136.46,44.29 IC4.1
  Top 0.61: D2.C D1.C | v121.79,35.14 121.79,36.14 128.68,43.03 C6.1 | R56.1 v75.49,63.75 | v61.72,65.98 K2.1 K2.10
  L3 0.203: v43.64,68.73 43.8,68.9 43.81,68.9
  L3 0.254: v60.88,76.15 60.88,75.64
  L3 0.508: v121.67,23.18 117.16,23.18 116.7,23.64 114.66,23.64 113.84,22.82 44.98,22.82 v44.02,23.79 | v44.02,28.03 44.01,38.01 44.55,38.56 44.55,39.37 43.81,40.11 43.81,68.9 43.81,72.19 47.27,75.64 60.88,75.64 62.45,75.64 65.96,79.16 65.96,81.26 X7.16
  L3 0.61: v75.49,63.75 63.94,63.75 v61.72,65.98
  Bottom 0.508: v44.02,28.03 v44.02,23.79
  Bottom 0.61: v121.92,18.61 121.79,18.73 121.79,23.05 v121.67,23.18 121.79,23.3 v121.79,35.14
+15V_ISO  (via drill 0.4)
  Top 0.152: 82.68,32.23 v82.68,32.58
  Top 0.254: v54.04,50.42 53.68,50.42 C57.1
  Top 0.305: IC11.24 83.35,48.87 C51.2 | 75.68,41.56 C63.1 | v75.69,40.7 75.73,41.53 C63.1 | IC12.24 83.35,32.17 C62.2 | IC10.8 73.85,41.59 73.88,41.57 C63.1
  Top 0.406: C51.2 83.03,49.11 C49.1 81.43,49.11 v80.71,48.39 | D12.2 v68.33,38.17 v68.33,38.16 | IC15.8 53.6,48.7 53.21,49.09 C57.1 | 83.35,32.17 82.74,32.17 | 82.74,32.17 82.24,32.17 C59.1 | 82.68,32.23 82.74,32.17 | D11.2 v69.92,56.77 v69.91,56.77 | C13.1 134.09,35.58 v133.99,35.69 133.99,36.36 IC5.1 | D14.2 25.91,41.34 v25.91,42.04 | IC19.8 72.52,30.83 C71.2 72.03,30.86 v71.44,30.86 | IC18.8 64.97,30.83 C72.2 64.48,30.86 v63.88,30.86 | IC17.8 57.35,30.83 C73.2 56.86,30.86 v56.26,30.86 | IC16.8 49.73,30.83 C74.2 49.47,29.41 v49.15,29.1 | D13.2 v25.05,45.68 | 35.49,39.97 35.49,39.03 v35.53,38.99 35.53,38.25 R59.1 | 35.49,39.97 35.49,41.87 v35.45,41.92 | Q7.E 35.48,39.98 35.49,39.97
  Top 0.61: 134.09,36.32 IC5.1
  Top 1.016: v49.15,29.1 v41.27,29.1
  L3 0.406: 75.69,36.07 70.55,36.07 68.45,38.16 v68.33,38.16 | 75.69,34.42 75.44,34.67 58.9,34.67 54.04,39.53 v54.04,50.42 | v25.91,42.04 25.91,44.82 v25.05,45.68
  L3 0.508: v35.53,38.99 41.27,38.99 | X7.20 60.88,81.26 60.88,79.35 59.03,77.5 45.81,77.5 41.27,72.96 v41.27,56.77
  L3 1.016: v133.99,35.69 124.46,35.69 115.63,26.86 113.45,26.86 112.52,25.93 86.59,25.93 85.7,26.82 79.92,26.82 | v51.12,56.77 v69.91,56.77 v75.12,56.77 | v41.27,29.1 41.27,38.99 v41.27,56.77 | v75.69,40.7 75.69,36.07 75.69,34.42 76.58,33.53 76.58,30.86 | 79.95,32.58 79.95,26.85 79.92,26.82 | 79.95,32.58 79.95,47.62 v80.71,48.39 | v82.68,32.58 79.95,32.58 | 76.58,30.86 v71.44,30.86 v63.88,30.86 v56.26,30.86 50.91,30.86 v49.15,29.1 | 76.58,30.86 76.58,30.04 79.79,26.82 79.92,26.82
  Bottom 0.406: v25.91,42.04 35.33,42.04 v35.45,41.92
  Bottom 1.016: v41.27,56.77 v51.12,56.77
+VSENSE1
  Top 0.254: 73.79,48.58 72.9,48.58 72.58,48.26 IC10.2 | IC10.1 73.85,48.52 73.79,48.58 | IC11.22 81.55,52.08 81.03,51.56 81.03,50.48 79.12,48.58 73.79,48.58
+VSENSE2  (via drill 0.4)
  Top 0.203: 83.34,35.37 IC12.22
  Top 0.254: 72.58,40.83 72.77,40.83 73.47,40.13 73.47,37.21 v73.66,37.02 | 72.58,40.83 71.5,40.83 71.31,41.02 IC10.6 | IC10.7 72.58,40.84 72.58,40.83 | IC12.22 81.93,35.38 v81.72,35.18
  Bottom 0.254: v81.72,35.18 81.53,35.37 75.31,35.37 v73.66,37.02
-5V_ISO  (via drill 0.4)
  Top 0.406: D9.A C23.2
  Top 0.508: v120.84,28.51 C23.2
  Top 0.61: D10.A D9.A
  L3 0.508: v45.05,28.02 44.96,28.11 44.96,37.77 45.4,38.21 45.4,39.75 44.77,40.39 44.77,71.81 47.7,74.74 62.76,74.74 67.23,79.21 X7.15 | v120.84,28.51 120.59,28.51 116.5,24.42 114.35,24.42 113.53,23.6 46.27,23.6 v45.05,24.82
  Bottom 0.508: v45.05,28.02 v45.05,24.82
-15V_IN
  Top 0.61: L3.P$2 C17.1
  pour Top (isolate 0.254): 136.08,40.07 142.75,40.07 142.75,35.94 140.84,35.94 140.02,35.12 140.02,34.48 139.95,34.42 139.26,34.42 139.26,35.18 138.56,35.88 136.02,35.88 136.02,40.07
-15V_ISO  (via drill 0.4)
  Top 0.203: 68.45,47.59 68.48,47.59 v69.03,48.13 | D12.1 v70.23,40.26 | C61.2 v87.38,32.08
  Top 0.254: IC11.1 88.99,48.87 C50.2 | v86.61,53.91 IC11.25 | v86.61,37.21 IC12.25 | 37.78,35.43 37.8,35.45 Q10.E v37.91,36.38 v37.91,36.39 R65.1 | 88.74,32.36 88.99,32.36
  Top 0.305: 88.99,32.36 IC12.1
  Top 0.406: C58.1 88.74,32.36 C61.2 | 68.45,47.59 C66.1 68.44,47.4 IC10.4 | 71.88,52.22 D11.1 v71.82,51.18 | 88.99,48.87 87.92,48.87 v87.88,48.83 | IC7.1 v143.26,36.33 | C16.2 143.98,36.33 v143.26,36.33 | v143.26,36.33 v143.26,36.32 | IC15.4 57.41,40.72 C60.1 57.56,40.58 v58.48,40.58 | v42.55,46.02 28.16,46.02 D13.1 28.02,45.47 28.02,40.22 27.83,40.41 D14.1
  Top 0.61: 90.89,49.09 C48.1 89.31,49.11 C50.2
  Top 1.016: v85.22,25.57 v85.22,29.72
  L3 0.406: v58.48,40.58 58.48,51.37 61.28,54.17 69.03,54.17 v69.03,48.13 | v71.82,51.18 71.82,54.04 71.69,54.17 | v70.23,40.26 70.23,54.1 70.29,54.17
  L3 0.508: 42.54,45.66 v42.55,46.02 42.55,72.56 46.57,76.58 59.35,76.58 62.16,79.39 X7.19
  L3 0.61: v85.72,53.91 85.47,54.17 71.69,54.17 70.29,54.17 69.03,54.17
  L3 0.813: v86.74,39.88 v86.74,46.48
  L3 1.016: v124.02,33.4 116.14,25.53 113.96,25.53 113.06,24.62 86.16,24.62 v85.22,25.57 79.15,25.57 75.37,29.34 51.13,29.34 48.59,26.8 43.64,26.8 42.55,27.89 v42.55,36.39 v42.55,46.02
  Bottom 0.254: v37.91,36.39 v42.55,36.39
  Bottom 1.016: v124.02,33.4 140.34,33.4 v143.26,36.32
  other vias: 85.72,54.8 85.72,55.69 85.72,53.02 86.61,53.02 86.61,55.69 86.61,54.8 85.72,38.1 86.61,38.1 86.61,38.99 85.72,38.99 85.72,37.21 86.61,36.32 85.72,36.32
  pour Bottom (isolate 0.406): 79.88,56.96 90.04,56.96 90.04,46.16 79.88,46.16
  pour Bottom (isolate 0.406): 79.88,40.2 90.04,40.2 90.04,29.4 79.88,29.4
-VSENSE  (via drill 0.4)
  Top 0.203: IC12.23 82.55,34.73 80.71,32.89 77.09,32.89 75.75,34.23 59.44,34.23 58.17,35.5 49.72,35.5 46.93,38.29 v46.93,39.31 | IC11.23 82.17,51.43 81.53,50.8 81.53,50.29 79.3,48.06 76.34,48.06 74.19,45.91 v71.18,45.91
  Top 0.305: K1.4 v50.23,69.38 | v69.34,69.38 K2.4
  Top 0.406: v40.26,69.85 v40.26,82.55 | v50.38,82.54 50.38,83.05 JP4.1 JP2.3
  Bottom 0.203: v46.93,39.31 40.45,45.78 31.88,45.78 28.89,48.77 21.97,48.77 19.68,46.48 18.36,46.48 SH1.2 19.1,46.47 19.37,46.74 21.79,49.15 29.08,49.15 32.07,46.16 40.66,46.16 41.5,45.33 67.04,45.33 67.94,46.23 70.87,46.23 v71.18,45.91
  Bottom 0.305: v50.23,69.38 v69.34,69.38
  Bottom 0.406: SH1.2 20.57,48.7 20.57,79.88 23.24,82.55 v40.26,82.55 50.37,82.55 v50.38,82.54 | v50.23,69.38 49.76,69.85 v40.26,69.85
ADC_CLK/SCL1  (via drill 0.4)
  Top 0.203: IC8.137 104.46,66.29 103.82,66.29 100.78,69.34 99.82,69.34 v94.44,74.73
  Bottom 0.203: X7.4 83.76,81.26 83.76,78.99 84.7,78.05 88.11,78.05 91.44,74.73 v94.44,74.73
ADC_MISO  (via drill 0.4)
  Top 0.203: RN5.3 101.04,71.87 v101.04,71.91
  Bottom 0.203: X7.8 78.66,81.28 78.66,79.31 81.57,76.4 87.43,76.4 90.78,73.05 93.37,73.05 94.16,72.26 100.69,72.26 v101.04,71.91
ADC_MOSI  (via drill 0.4)
  Top 0.203: RN5.4 97.8,73.83 v97.69,73.83
  Bottom 0.203: X7.3 82.48,79.08 83.92,77.64 87.95,77.64 91.31,74.27 93.89,74.27 94.34,73.83 v97.69,73.83
ADC_SCK  (via drill 0.4)
  Top 0.203: RN5.2 100.8,73.38 v100.75,73.38
  Bottom 0.203: X7.6 81.22,81.27 81.22,79.07 83.06,77.23 87.77,77.23 91.14,73.86 93.71,73.86 94.5,73.08 100.44,73.08 v100.75,73.38
ADC_START/SDA1  (via drill 0.4)
  Top 0.203: IC8.136 104.72,66.74 104.01,66.74 99.2,71.55 v98.67,71.55
  Bottom 0.203: X7.10 76.12,81.28 76.12,79.25 76.67,78.7 78.12,78.7 81.23,75.59 87.08,75.59 90.44,72.24 91.85,72.24 92.84,71.25 98.36,71.25 v98.67,71.55
ADIB1_ID0  (via drill 0.4)
  Top 0.203: IC8.82 127.97,63.79 v127.6,63.79
  Bottom 0.203: X5.7 48.01,87.01 49.42,87.01 54.08,91.67 131.29,91.67 134.19,88.77 134.19,73.34 128.92,68.07 128.92,64.67 128.04,63.79 v127.6,63.79
ADIB1_ID1  (via drill 0.4)
  Top 0.203: IC8.81 127.95,63.07 126.72,63.07 v126.63,63.16
  Bottom 0.203: X5.9 54.26,91.26 131.12,91.26 133.78,88.59 133.78,73.51 128.51,68.24 128.51,65.72 126.63,63.84 v126.63,63.16
ADIB1_ID2  (via drill 0.4)
  Top 0.203: IC8.80 127.64,62.05 v126.48,62.05
  Bottom 0.203: v126.48,62.05 126.89,62.05 130.16,65.33 130.16,66.99 134.59,71.42 134.59,88.95 131.47,92.08 51.08,92.08 X5.8
ADIB1_R  (via drill 0.4)  (1 unrouted)
  Top 0.203: IC21.5 80.83,67.29 v81.97,68.43 | IC8.101 119,68.26 119,65.82 v118.26,65.09
  Bottom 0.203: 118.29,65.08 103.92,65.08 102.38,66.62 101.28,66.62 100.65,67.26 92.65,67.26 91.8,68.11 82.28,68.11 v81.97,68.43
ADIB1_S  (via drill 0.4)
  Top 0.203: IC8.117 113.31,71.59 113.31,71.67 111.61,73.37 v110.67,73.37 | IC21.2 78.88,68.37 78.66,68.58 78.66,69.23 79.44,70 v79.54,70 | v91.52,75.72 90.53,75.72 v86.87,72.06
  Bottom 0.203: v79.54,70 80.24,70.7 85.47,70.7 86.83,72.06 v86.87,72.06 | v91.52,75.72 108.32,75.72 v110.67,73.37
ADIB1N
  Top 0.254: K1.2 45.15,73.32 43.89,74.57 43.89,84.04 43,84.93 X5.3 44.01,87 44.01,88.58 44.45,89.03 53.76,89.03 JP2.2
ADIB1P  (via drill 0.4)
  Top 0.254: X5.4 41.97,89.03 37.8,89.03 JP3.2 | K1.9 44.36,77.34 44.36,84.61 v44.01,84.96
  Bottom 0.254: v44.01,84.96 44.01,87 X5.4
ADIB2_ID0  (via drill 0.4)
  Top 0.203: IC8.87 127.62,66.98 127.62,67.7 131.17,71.25 v131.17,72.49
  Bottom 0.203: X6.7 68,87 69.66,87 73.11,90.45 130.76,90.45 132.97,88.24 132.97,73.9 131.56,72.49 v131.17,72.49
ADIB2_ID1  (via drill 0.4)
  Top 0.203: IC8.86 128.03,66.68 128.03,67.49 131.9,71.36 v131.9,73.89
  Bottom 0.203: v131.9,73.89 132.56,74.55 132.56,88.08 130.59,90.04 73.36,90.04 69.31,86 X6.9
ADIB2_ID2  (via drill 0.4)
  Top 0.203: IC8.85 126.74,64.68 v126.21,64.68
  Bottom 0.203: v126.21,64.68 126.89,64.68 128.09,65.89 128.09,68.42 133.38,73.7 133.38,88.42 130.94,90.86 69.86,90.86 X6.8
ADIB2_R  (via drill 0.4)
  Top 0.203: IC21.12 79.53,71 77.44,68.92 v77.44,65.13 | v92.55,63.77 92.55,67.77 v92.85,68.07 | IC8.103 117.56,68.24 117.56,66.17 v117.7,66.03
  Bottom 0.203: v77.44,65.13 77.65,64.92 88.05,64.92 89.14,63.83 92.48,63.83 v92.55,63.77 | v92.85,68.07 93.26,67.67 100.81,67.67 101.45,67.03 102.54,67.03 103.54,66.03 v117.7,66.03 117.73,66
ADIB2_S  (via drill 0.4)
  Top 0.203: IC21.9 81.47,70.02 v81.9,69.6 | IC8.102 118.29,68.25 v118.29,66.99
  Bottom 0.203: v81.9,69.6 81.92,69.58 100.56,69.58 103.71,66.43 116.73,66.43 117.28,66.99 v118.29,66.99
ADIB2N
  Top 0.254: X6.3 63.41,85.59 63.41,79.34 62.99,78.92 62.99,74.93 64.26,73.66 K2.2
  Bottom 0.254: X6.3 63,85.42 62.24,84.66 55.97,84.66 JP4.2
ADIB2P
  Top 0.254: JP5.2 35.59,86.64 35.59,88.33 37.07,89.81 61.19,89.81 X6.4 64.01,86.99 64.01,85.1 65.98,83.13 65.98,78.27 K2.9
AFE1N
  Top 0.254: JP2.1 55.98,86.81 55.98,84.09 55.82,83.92 55.82,81.28 X7.25 54.04,80 51.5,77.46 51.5,71.91 K1.3
AFE1P  (via drill 0.4)
  Top 0.254: K1.8 v47.69,83.36 | JP3.3 39.83,86.56 39.83,84.67 v41.02,83.48
  Bottom 0.254: X7.26 53.35,83.73 51.58,83.73 51.21,83.36 v47.69,83.36 41.13,83.36 v41.02,83.48
AFE2N  (via drill 0.4)
  Top 0.254: JP4.3 58.34,84.28 58.34,81.26 X7.23 57.47,79.61 57.47,71.22 v57.61,71.08 | K2.3 v66.8,71.08
  Bottom 0.254: v57.61,71.08 v66.8,71.08
AFE2P  (via drill 0.4)
  Top 0.254: X7.24 57.08,81.67 55.87,80.45 v55.87,78.45 | v65.96,76.56 K2.8
  Bottom 0.254: v55.87,78.45 64.07,78.45 v65.96,76.56 | JP5.1 40,84.23 55.39,84.23 X7.24
AFE_CLK  (via drill 0.4)
  Top 0.203: v120.84,69.04 120.84,69.39 IC8.100
  Bottom 0.203: X7.14 71.03,81.29 71.03,79.06 72.2,77.89 77.76,77.89 80.87,74.78 86.72,74.78 90.69,70.8 101.09,70.8 102.4,69.49 106.63,69.49 108.47,67.65 116.24,67.65 116.88,68.29 117.17,68.58 117.63,69.04 v120.84,69.04
AFE_ID0  (via drill 0.4)
  Top 0.152: v127.08,56.01 127.08,54.99 IC8.60 | X8.1 85.36,18 86.41,19.05 87.43,19.05 87.85,19.47 87.85,20.48 93.15,25.79 107.11,25.79 v108.41,27.09
  Bottom 0.152: v127.08,56.01 128.27,54.81 128.27,44.6 118.26,34.59 118.26,30.87 114.48,27.09 v108.41,27.09
AFE_ID1  (via drill 0.4)
  Top 0.152: v126.39,55.24 126.39,54.97 IC8.59 | v87.17,19.75 87.17,20.24 93.08,26.15 106.92,26.15 107.63,26.86 107.63,27.24 108.27,27.88 v108.27,28.09
  Bottom 0.152: v126.39,55.24 127.91,53.72 127.91,44.76 117.91,34.75 117.91,31.03 114.43,27.55 109.03,27.55 108.48,28.09 v108.27,28.09 | v87.17,19.75 86.38,20.54 X8.2
BIAS_EN  (via drill 0.4)
  Top 0.152: v77.2,45.19 77.67,44.72 93.75,44.72 96.19,47.16 97.21,47.16 v97.38,46.98 | IC8.58 125.31,55.35 121.32,55.35 v120.19,54.22
  Top 0.203: v37.88,42.34 37.15,42.34 R62.1
  L3 0.203: v40.07,48.36 37.88,46.18 v37.88,42.34
  Bottom 0.152: v97.38,46.98 97.38,47.89 101.21,51.71 106.92,51.71 109.23,54.03 110.66,54.03 110.87,54.24 120.17,54.24 v120.19,54.22
  Bottom 0.203: v40.07,48.36 46.44,48.36 47.62,47.18 60.07,47.18 60.62,47.73 67.84,47.73 68.63,46.94 75.45,46.94 v77.2,45.19
BOOT0  (via drill 0.4)
  Top 0.152: v112.1,52.81 112.1,59.66 v111.82,59.94 | IC3.13 103.19,20.83 109.27,26.91 v109.27,28.63
  Top 0.203: R5.2 102.74,65.79 104.26,65.79 IC8.138 109.67,60.38 v109.67,59.94
  L3 0.152: v112.1,52.81 112.1,51.84 109.89,49.63 109.89,39.98 v109.87,39.92
  Bottom 0.152: v109.87,39.92 109.87,36.13 110.08,35.92 110.08,32.44 109.91,32.26 109.91,29.64 109.27,29.01 v109.27,28.63
  Bottom 0.203: v111.82,59.94 v109.67,59.94
CLAMP  (via drill 0.4)
  Top 0.254: R30.1 v24.7,81.72
  Top 0.305: R29.2 26.16,82.74 | 26.16,82.74 R30.1 IC20.1 22.35,82.68 | C76.1 26.17,82.74 26.16,82.74 | D15.2 27.62,77.91 v27.37,78.17 | D16.2 27.62,74.23 v27.37,74.49 | D17.2 27.62,70.55 v27.37,70.8 | D18.2 27.62,66.86 v27.37,67.12 | D19.2 27.62,63.18 v27.37,63.44 | D20.2 27.56,59.5 v27.37,59.69 | D21.2 27.56,55.81 v27.37,56.01 | D22.2 27.62,52.13 v27.37,52.39 | C75.1 v31.62,81.6
  Top 0.406: D28.2 32.07,22.92 v32,22.99 | D27.2 v29.97,31.88
  L3 0.406: v32,22.99 29.97,25.02 v29.97,31.88 29.97,34.73 27.37,37.34 27.37,51.88
  other vias: 29.15,81.6 29.97,81.6 26.67,81.72
  pour L3 (isolate 0.254): 21.59,82.04 31.94,82.04 31.94,78.87 28.7,78.87 28.7,51.44 26.8,51.44 26.8,78.87 21.59,78.87
DAC_CLR#1  (via drill 0.4)
  Top 0.203: IC11.6 93.61,54.03 94.61,53.02 v96.97,53.02 | IC8.50 123.32,51.68 v123.32,52.07
  Bottom 0.152: v96.97,53.02 96.98,53.02 97.95,54 106.02,54 109.72,57.7 118.14,57.7 121.92,53.91 121.92,52.55 122.4,52.07 v123.32,52.07
DAC_CLR#2  (via drill 0.4)
  Top 0.152: v124.51,54.69 124.51,54.02 IC8.55 | IC12.6 89.01,37.31 90.58,37.31 90.91,37.64 103.77,37.64 104.46,38.33 110.9,38.33 111.1,38.12 112.93,38.12 114.05,39.24 v115.09,39.24
  Bottom 0.152: v124.51,54.69 124.51,54.02 125.72,52.82 125.72,45.21 119.75,39.24 v115.09,39.24
DAC_CLR-SEL#1  (via drill 0.4)
  Top 0.152: IC8.53 124.26,52.86 123.46,52.86 122.72,53.59 v121.22,53.59
  Top 0.203: v96.14,52.26 95.82,52.58 94.42,52.58 93.41,53.59 90.27,53.59 90.06,53.38 IC11.5
  Bottom 0.152: v96.14,52.26 97.28,52.26 98.67,53.65 106.17,53.65 109.87,57.34 117.98,57.34 121.22,54.1 v121.22,53.59
DAC_CLR-SEL#2  (via drill 0.4)
  Top 0.152: IC8.56 125.37,53.87 v125.37,54.08 | IC12.5 90.39,36.68 91.05,37.34 103.9,37.34 104.58,38.02 110.77,38.02 110.97,37.82 113.06,37.82 113.78,38.54 v114.41,38.54
  Bottom 0.152: v125.37,54.08 126.07,53.38 126.07,45.07 119.55,38.54 v114.41,38.54
DAC_CS#1  (via drill 0.4)
  Top 0.203: v96.2,53.78 95.89,53.47 94.87,53.47 93.73,54.61 90.68,54.61 90.61,54.68 IC11.7 | IC8.49 122.56,51.74 v122.56,52.83
  Bottom 0.152: v96.2,53.78 96.2,53.8 96.76,54.36 105.88,54.36 109.58,58.05 118.29,58.05 122.56,53.78 v122.56,52.83
DAC_CS#2  (via drill 0.4)  (1 unrouted)
  Top 0.152: IC8.54 124.3,53.53 v123.98,53.53 | IC12.7 90.53,37.98 90.56,37.95 103.61,37.95 104.29,38.63 111.02,38.63 111.23,38.43 112.8,38.43 114.26,39.89 114.28,39.89
  Bottom 0.152: v123.98,53.53 124.3,53.53 125.41,52.41 125.41,45.41 119.89,39.89 v114.36,39.89
DAC_MISO  (via drill 0.4)
  Top 0.203: RN6.3 134.56,65.47 v134.56,65.6 | v95,55.37 95,56.2 94.3,56.9 93.66,56.9 93.4,56.63 IC11.10 | IC12.10 92,39.93 92.08,40.01 93.09,40.01 v93.15,39.94
  Bottom 0.152: 134.43,65.47 131.51,65.47 124.8,58.76 109.27,58.76 105.58,55.07 95.87,55.07 95.57,55.37 v95,55.37
  Bottom 0.203: v134.56,65.6 134.43,65.47 | v95,55.37 94.42,54.8 94.42,45.53 93.15,44.26 v93.15,39.94
DAC_MOSI  (via drill 0.4)
  Top 0.203: RN6.4 133.73,65.92 v133.73,66.23 | IC14.8 65.09,47.24 66.17,48.32 66.17,55.5 v66.1,55.56 | IC12.9 92.29,39.28 v92.39,39.18 | IC11.9 90.53,55.98 90.68,56.13 v93.98,56.13
  Bottom 0.152: v133.73,66.23 131.64,66.23 124.52,59.12 109.12,59.12 105.44,55.44 96.01,55.44 95.31,56.13 v93.98,56.13
  Bottom 0.203: v92.39,39.18 92.39,44.13 93.98,45.72 v93.98,56.13 93.47,56.64 91.06,56.64 89.83,57.87 68.42,57.87 v66.1,55.56
DAC_OUT#1  (via drill 0.4)
  Top 0.254: v16.32,47.82 16.83,47.31 16.83,44.05 X3.2 | K1.7 v50.23,78.5 | v33.16,81.72 33.16,86.39 JP3.1
  Top 0.305: 73.75,51.97 L5.P$2 73.79,51.94 71.92,50.08 D11.3 68.53,50.08 TVS1.C2 67.31,48.87 67.31,46.61 v66.74,46.04 | C44.1 23.37,45.28 25.53,47.43 32.26,47.43 v32.45,47.62
  Top 0.406: X3.2 21.1,45.28 C44.1
  Bottom 0.254: JP3.1 33.13,86.36 25.21,86.36 19.24,80.39 19.24,50.74 v16.32,47.82 | v50.23,78.5 40.15,78.5 36.64,82 33.44,82 v33.16,81.72
  Bottom 0.305: v32.45,47.62 32.64,47.43 42.49,47.43 44.13,45.8 66.5,45.8 v66.74,46.04
DAC_OUT#2  (via drill 0.4)
  Top 0.254: X3.3 16.07,41 16.07,46.42 v16,46.48 | K2.7 69.34,76.28 v68.69,75.63 | v34.57,81.04 34.58,81.39 JP5.3
  Top 0.305: C53.1 22.63,40.9 v23.37,41.63 | TVS2.C2 64.6,34.72 59.63,34.72 58.34,36.01 50.33,36.01 v50.08,36.26
  Top 0.406: TVS2.C2 66.88,37 D12.3 69.53,37.25 L6.P$2 | X3.3 20.53,40.9 C53.1
  Bottom 0.254: JP5.3 25.58,85.65 20,80.07 20,50.23 16.26,46.48 v16,46.48 | v68.69,75.63 68.4,75.34 42.19,75.34 36.49,81.04 v34.57,81.04
  Bottom 0.305: v23.37,41.63 24.3,40.7 43.02,40.7 44.45,39.27 44.45,38.84 47.03,36.26 v50.08,36.26
DAC_SCK  (via drill 0.4)
  Top 0.203: RN6.2 135.26,64.9 v135.32,64.9 | v95.19,54.23 95.06,54.23 93.96,55.33 91.04,55.33 v91,55.37 90.95,55.33 IC11.8 | v93.47,38.86 93.03,38.42 92.08,38.42 91.86,38.63 IC12.8 | IC14.7 65.29,46.74 66.61,48.07 66.61,54.99 v67.18,55.56
  Bottom 0.152: 135.25,64.83 131.51,64.83 125.08,58.41 109.42,58.41 105.73,54.71 95.67,54.71 v95.19,54.23
  Bottom 0.203: v135.32,64.9 135.25,64.83 | v95.19,54.23 94.87,53.91 94.87,45.34 93.92,44.39 93.92,39.31 v93.47,38.86 | v91,55.37 91,56.07 89.55,57.52 69.14,57.52 v67.18,55.56
DIB_A0  (via drill 0.4)
  Top 0.203: v94.17,13.74 v94.17,13.75 IC1.1 94.17,15.94 93.71,16.4 RN3.3
  Bottom 0.203: X1.17 76.14,11.26 76.14,12.95 76.89,13.7 94.13,13.7 v94.17,13.74
DIB_A1
  Top 0.203: X1.19 77.4,9.96 78.68,11.24 90.08,11.24 92.9,14.06 IC1.2 92.81,15.26 RN3.2
DIB_A2
  Top 0.203: X1.18 75.3,12.5 76.52,13.72 90.91,13.72 91.57,14.38 91.57,15.11 IC1.3 91.62,15.18 91.62,15.98 91.91,16.27 RN3.1
DIB_BOOT  (via drill 0.4)
  Top 0.203: v103.19,10.73 IC3.4
  Bottom 0.203: X1.26 86.23,11.27 86.23,9.08 87.63,7.68
  Bottom 0.254: 87.63,7.68 100.14,7.68 v103.19,10.73
DIB_CSA
  Top 0.203: IC2.5 115.06,12.7 114.24,11.87 RN1.2
DIB_CSB  (via drill 0.4)
  Top 0.203: X1.12 67.22,12.47 68.52,11.18 68.52,9.21 72.26,5.46 108.2,5.46 v108.52,5.14
  Bottom 0.254: JP1.NO 108.52,5.39 v108.52,5.14
DIB_IRQ  (via drill 0.4)
  Top 0.203: v105.16,3.81 104.84,4.13 68.07,4.13 63.44,8.76 63.44,11.26 X1.10
  Bottom 0.254: JP1.NC 106.3,3.81 v105.16,3.81
DIB_MISO
  Top 0.203: IC2.6 116.33,12.7 115.14,11.51 RN1.1
DIB_MOSI
  Top 0.203: IC2.3 112.52,11.15 RN1.4
DIB_NRESET  (via drill 0.4)
  Top 0.203: X1.4 58.36,11.2 58.36,9.08 64.2,3.24 100.97,3.24 101.6,2.6 102.23,2.6 103,3.37 v104.08,3.37 | v104.08,7.11 104.08,11.62 104.46,12 IC3.5
  Bottom 0.203: v104.08,7.11 v104.08,3.37
DIB_SCL  (via drill 0.4)
  Top 0.203: IC1.6 91.63,8.76 89.98,7.11 v76.26,7.11
  Bottom 0.203: v76.26,7.11 70.42,7.05 69.41,6.03 63.53,6.03 X1.5
DIB_SCLK
  Top 0.203: IC2.4 113.79,12.26 113.35,11.81 RN1.3
DIB_SDA  (via drill 0.4)
  Top 0.203: IC1.5 90.36,9.14 89.09,7.87 v75.56,7.87
  Bottom 0.203: v75.56,7.87 75.25,7.56 70.29,7.56 69.22,6.48 65.72,6.48 63.44,8.76 63.44,11.2 X1.8
DIN0  (via drill 0.4)
  Top 0.152: IC8.5 103.98,55.36 98.27,55.36 91.82,61.81 89.56,61.81
  Top 0.203: 31.18,76.96 31.18,77.02 | v30.73,77.47 31.56,77.47 R48.1 | 89.56,61.81 C77.1 C82.1 87.02,61.81 84.91,63.92 v84.91,71.56
  Top 0.305: R40.2 R48.1 31.18,76.96 D15.3 R32.2
  Bottom 0.203: v30.73,77.47 34.67,73.53 83.05,73.53 84.91,71.67 v84.91,71.56
DIN1  (via drill 0.4)
  Top 0.152: IC8.4 103.6,55.69 98.55,55.69 91.72,62.52 91.72,68.28 C83.1
  Top 0.203: R49.1 30.99,73.47 v30.67,73.79 | 89.64,70.7 C83.1 C78.1 87.11,70.7 85.47,72.34 v83.22,72.34
  Top 0.305: R33.2 D16.3 31.43,73.28 R49.1 R41.2
  Bottom 0.203: v30.67,73.79 31.37,73.09 68.75,73.04 82.53,73.04 v83.22,72.34
DIN2  (via drill 0.4)  (1 unrouted)
  Top 0.203: R50.1 31.24,69.53 v30.67,70.1 | v49.47,62.8 v49.47,58.55 | IC8.3 103.97,56.77 v102.55,56.77 102.49,56.71 C79.1
  Top 0.305: R34.2 D17.3 31.56,69.6 R50.1 R42.2
  Bottom 0.203: v30.67,70.1 36.77,64.01 48.26,64.01 v49.47,62.8 | 49.78,58.99 76.64,58.99 77.53,59.88 78.68,59.88 79.31,59.24 100.08,59.24 v102.55,56.77
DIN3  (via drill 0.4)
  Top 0.203: R51.1 31.62,65.97 v30.99,66.61 | v48.39,62.8 v48.39,59.12 | IC8.2 104.16,57.66 103.38,57.66 102.42,58.61 v102.42,58.74 102.36,58.67 C84.1
  Top 0.305: R43.2 R51.1 31.31,65.91 D18.3 R35.2
  Bottom 0.203: v30.99,66.61 33.53,66.61 36.58,63.56 47.62,63.56 v48.39,62.8 | v48.39,59.12 48.7,59.44 76.45,59.44 77.34,60.33 78.87,60.33 79.5,59.69 101.47,59.69 v102.42,58.74
DIN4  (via drill 0.4)
  Top 0.203: v47.31,62.8 v47.31,59.56 | v31.18,62.61 31.18,62.35 31.05,62.23 | IC8.1 103.05,60.11 v102.51,60.11 101.98,60.64 C80.1
  Top 0.305: R36.2 D19.3 31.05,62.23 R52.1 R44.2
  Bottom 0.203: v31.18,62.61 35.31,62.61 35.81,63.12 40.45,63.12 40.77,62.8 v47.31,62.8 | v47.31,59.56 47.62,59.88 76.26,59.88 77.15,60.77 79.06,60.77 79.69,60.13 102.49,60.13 v102.51,60.11
DIN5  (via drill 0.4)
  Top 0.203: R45.2 31.31,59.37 v30.73,60.01 | C85.1 98.04,61.91 98.36,62.23 v98.61,62.23 98.97,62.59 104.64,62.59 IC8.142
  Top 0.305: R45.2 R53.1 30.99,57.72 30.16,58.55 D20.3 R37.2
  Bottom 0.203: v30.73,60.01 33.4,60.01 35.88,62.48 38.86,62.48 39.69,61.66 75.54,61.66 76.49,62.61 93.08,62.61 93.65,63.18 97.41,63.18 98.36,62.23 v98.61,62.23
DIN6  (via drill 0.4)
  Top 0.203: R46.2 32,55.37 | C81.1 98.3,63.25 v98.36,63.31 98.68,62.99 104.94,62.99 IC8.141 | v40.07,62.36 40.07,59.24 35.75,54.93 v35.69,54.93 | 30.35,54.86 30.54,54.86 v30.67,54.99
  Top 0.305: R38.2 D21.3 30.35,54.86 31.24,55.75 R46.2 R54.1
  Bottom 0.203: v35.69,54.93 30.73,54.93 v30.67,54.99 | v40.07,62.36 40.32,62.1 75.4,62.1 76.34,63.04 92.93,63.04 93.48,63.6 98.07,63.6 v98.36,63.31
DIN7/MISO  (via drill 0.4)
  Top 0.152: v91.24,43.76 91.57,44.09 94.02,44.09 95.78,45.86 98.07,45.86 v98.98,46.77 | v119.28,53.3 119.28,53.07 120.1,52.25 120.1,49.24 IC8.42
  Top 0.203: IC8.42 122.31,47.03 C86.1 | R55.1 31.62,50.42 v31.18,50.86
  Top 0.305: R39.2 D22.3 31.5,51.18 31.62,51.31 | R55.1 31.62,51.31 | 31.62,51.31 R47.2